# EAGLE board SPU_Rev_2.1 (EAGLE 9.6.2), part 1 of 3
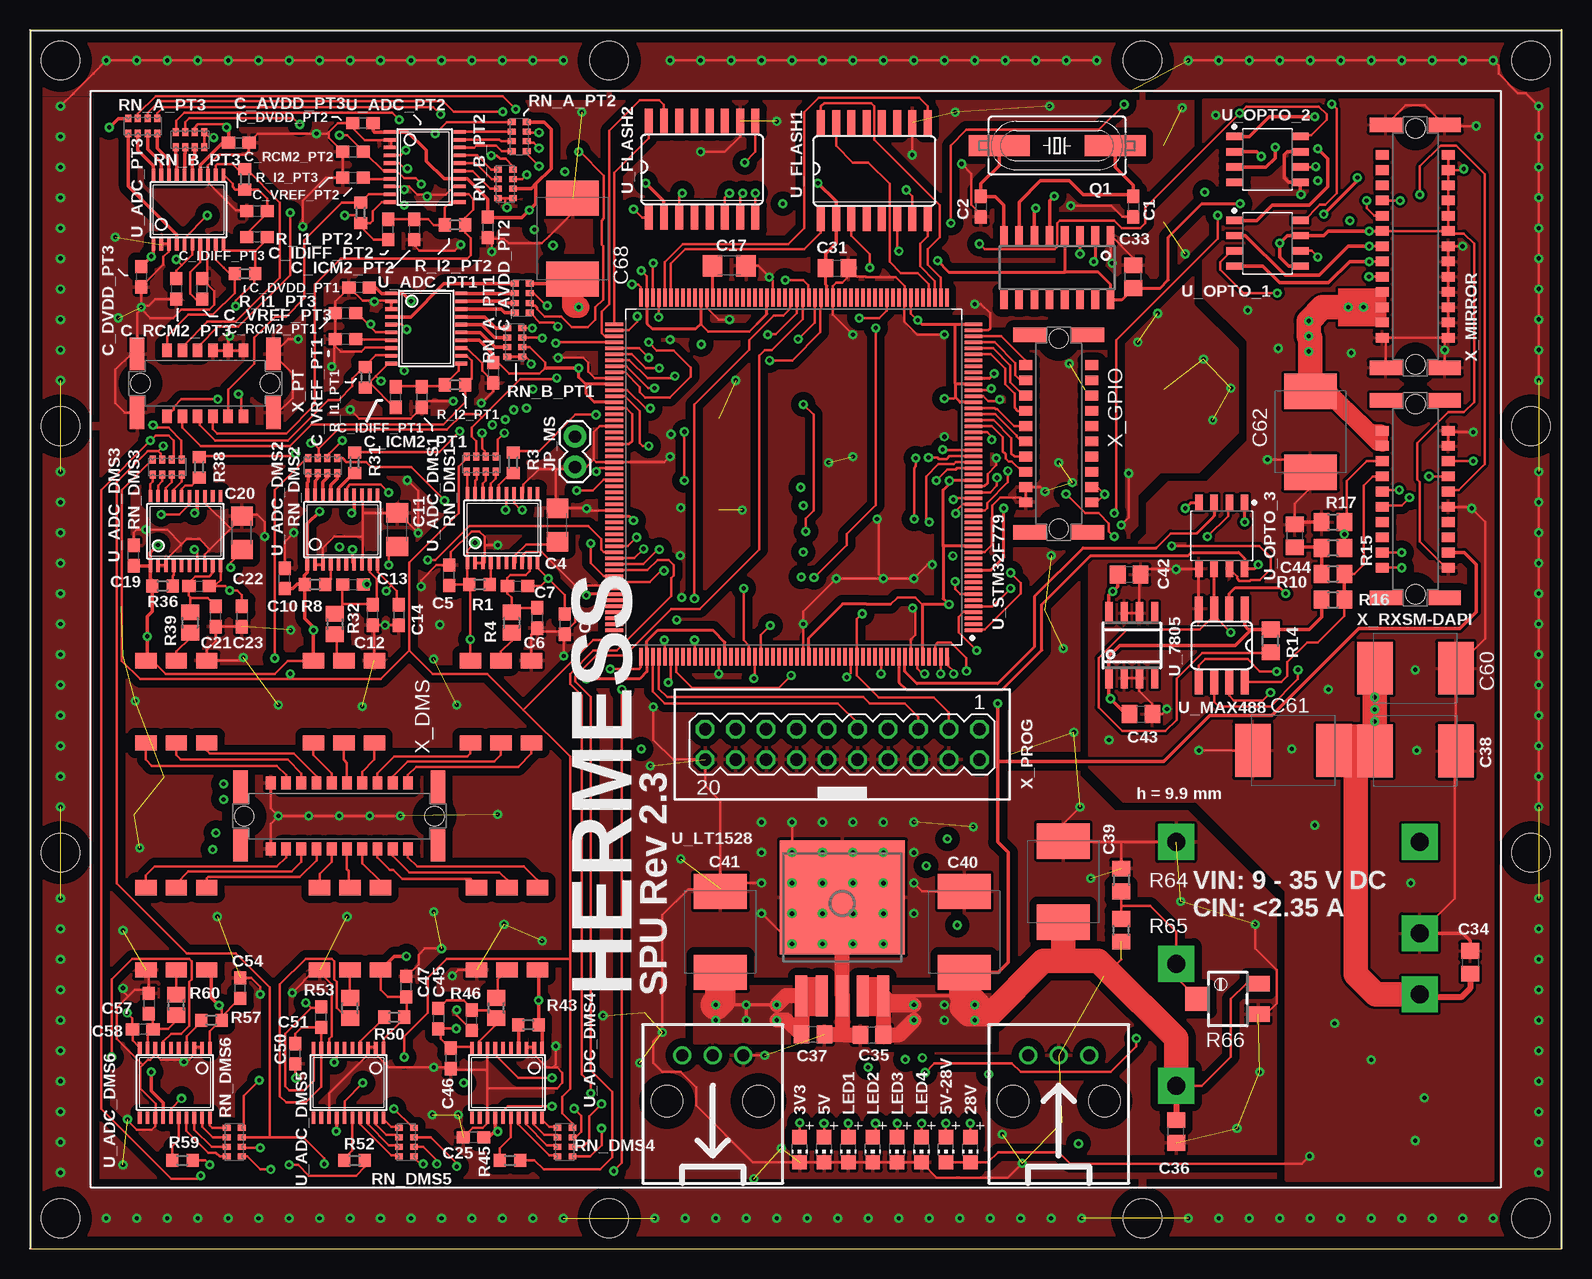
[diagram p8: board, top side]
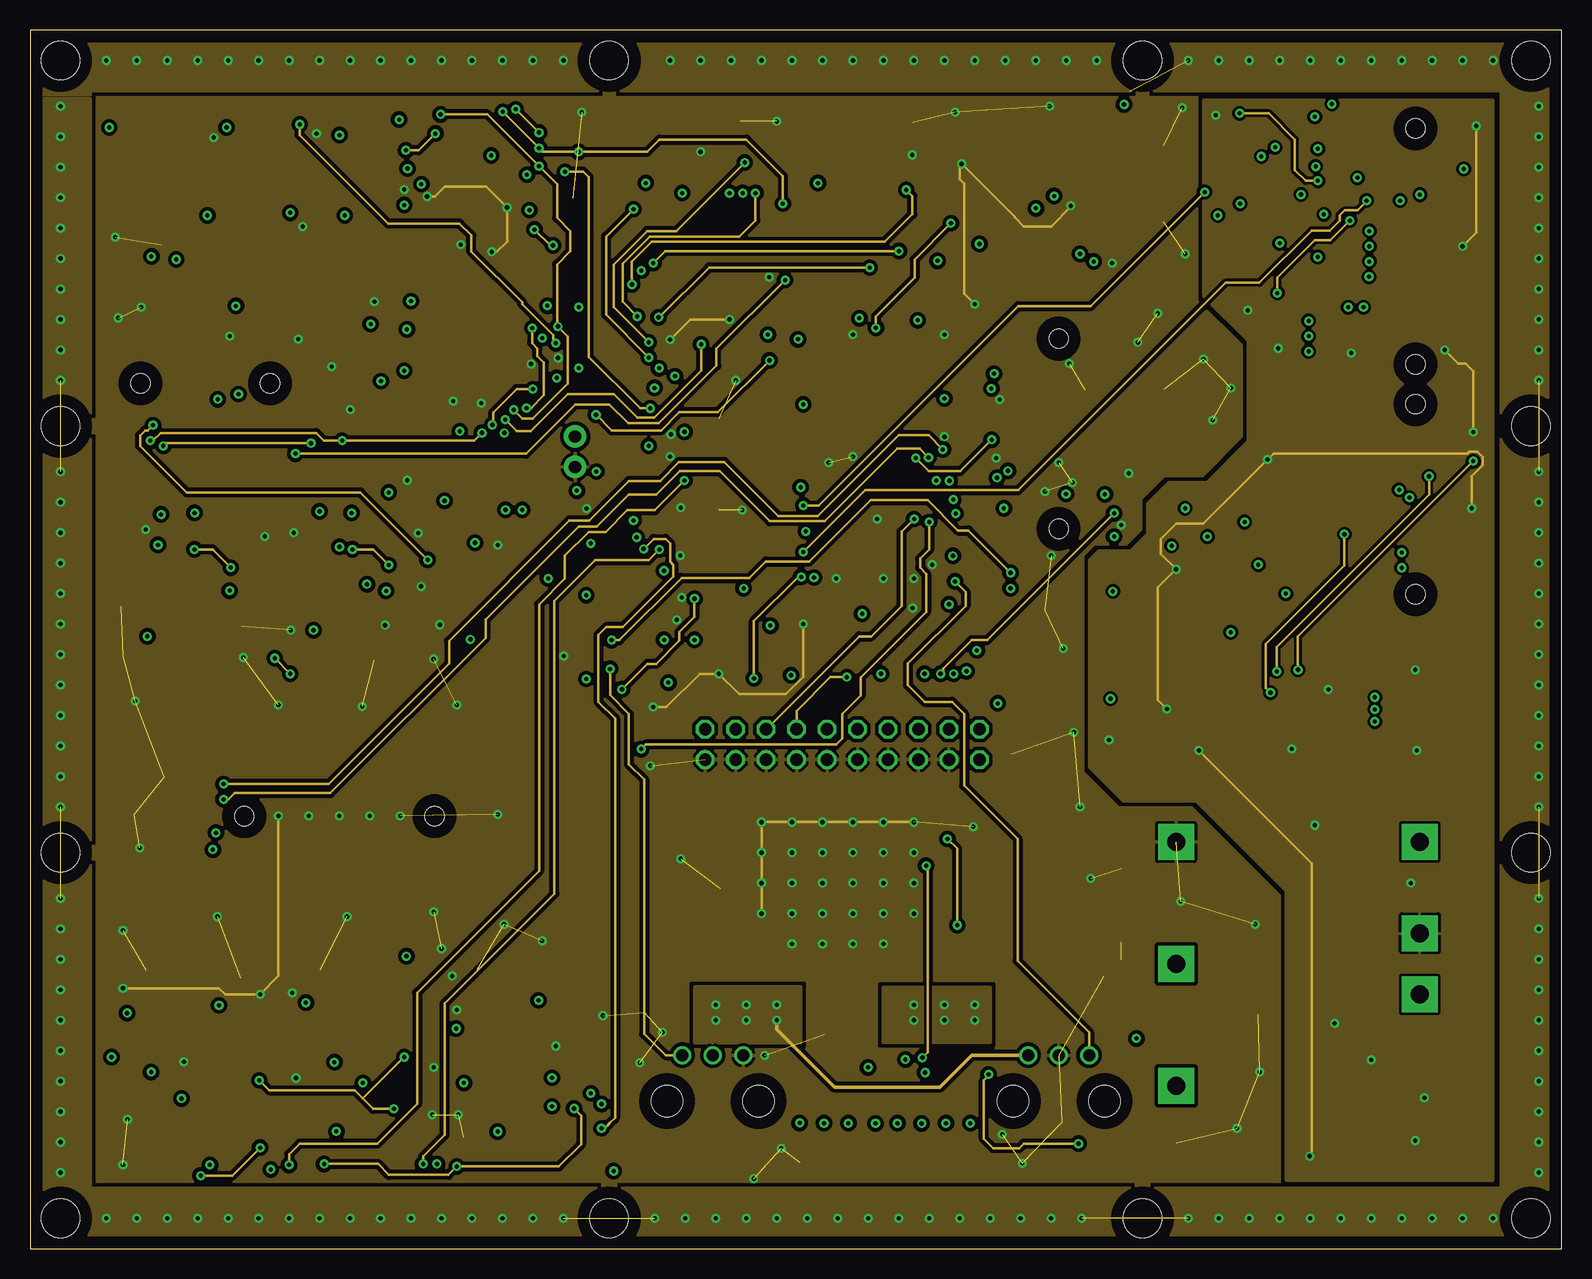
[diagram p9: board, inner layer Route2]
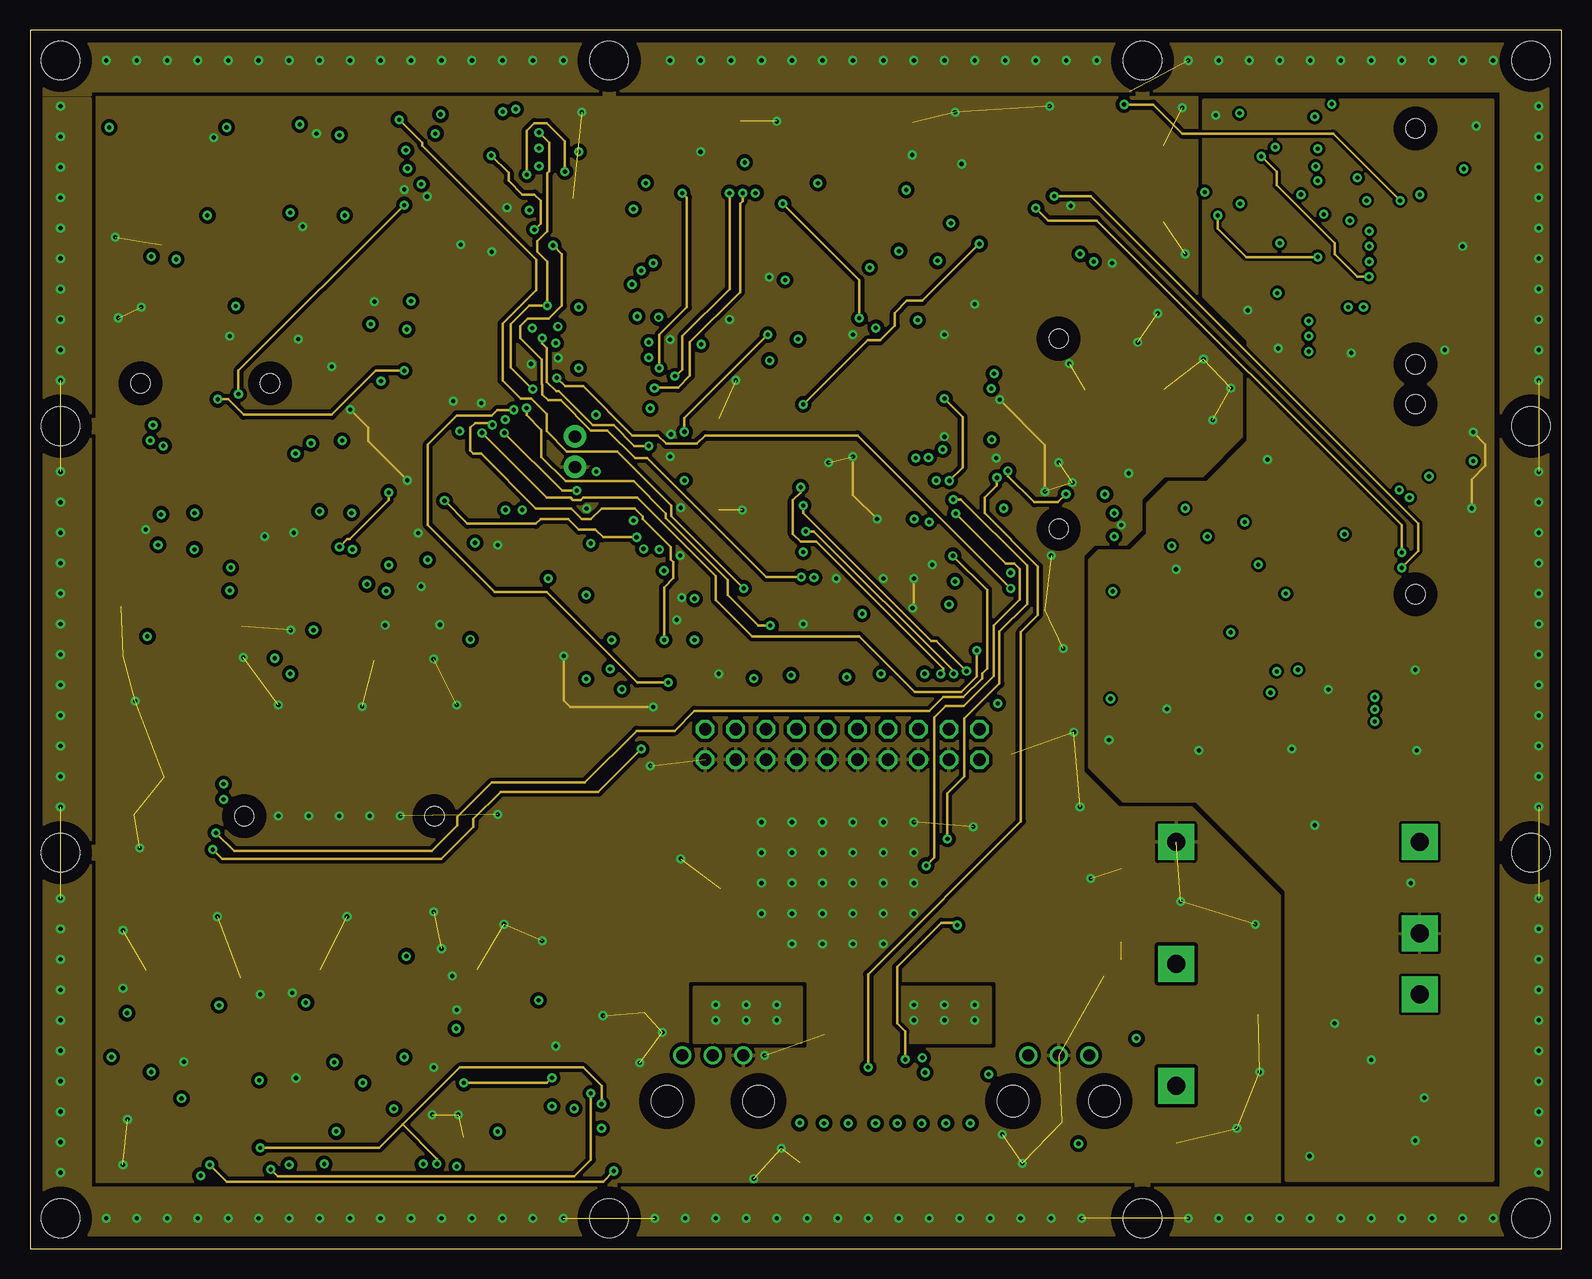
[diagram p10: board, inner layer Route15]
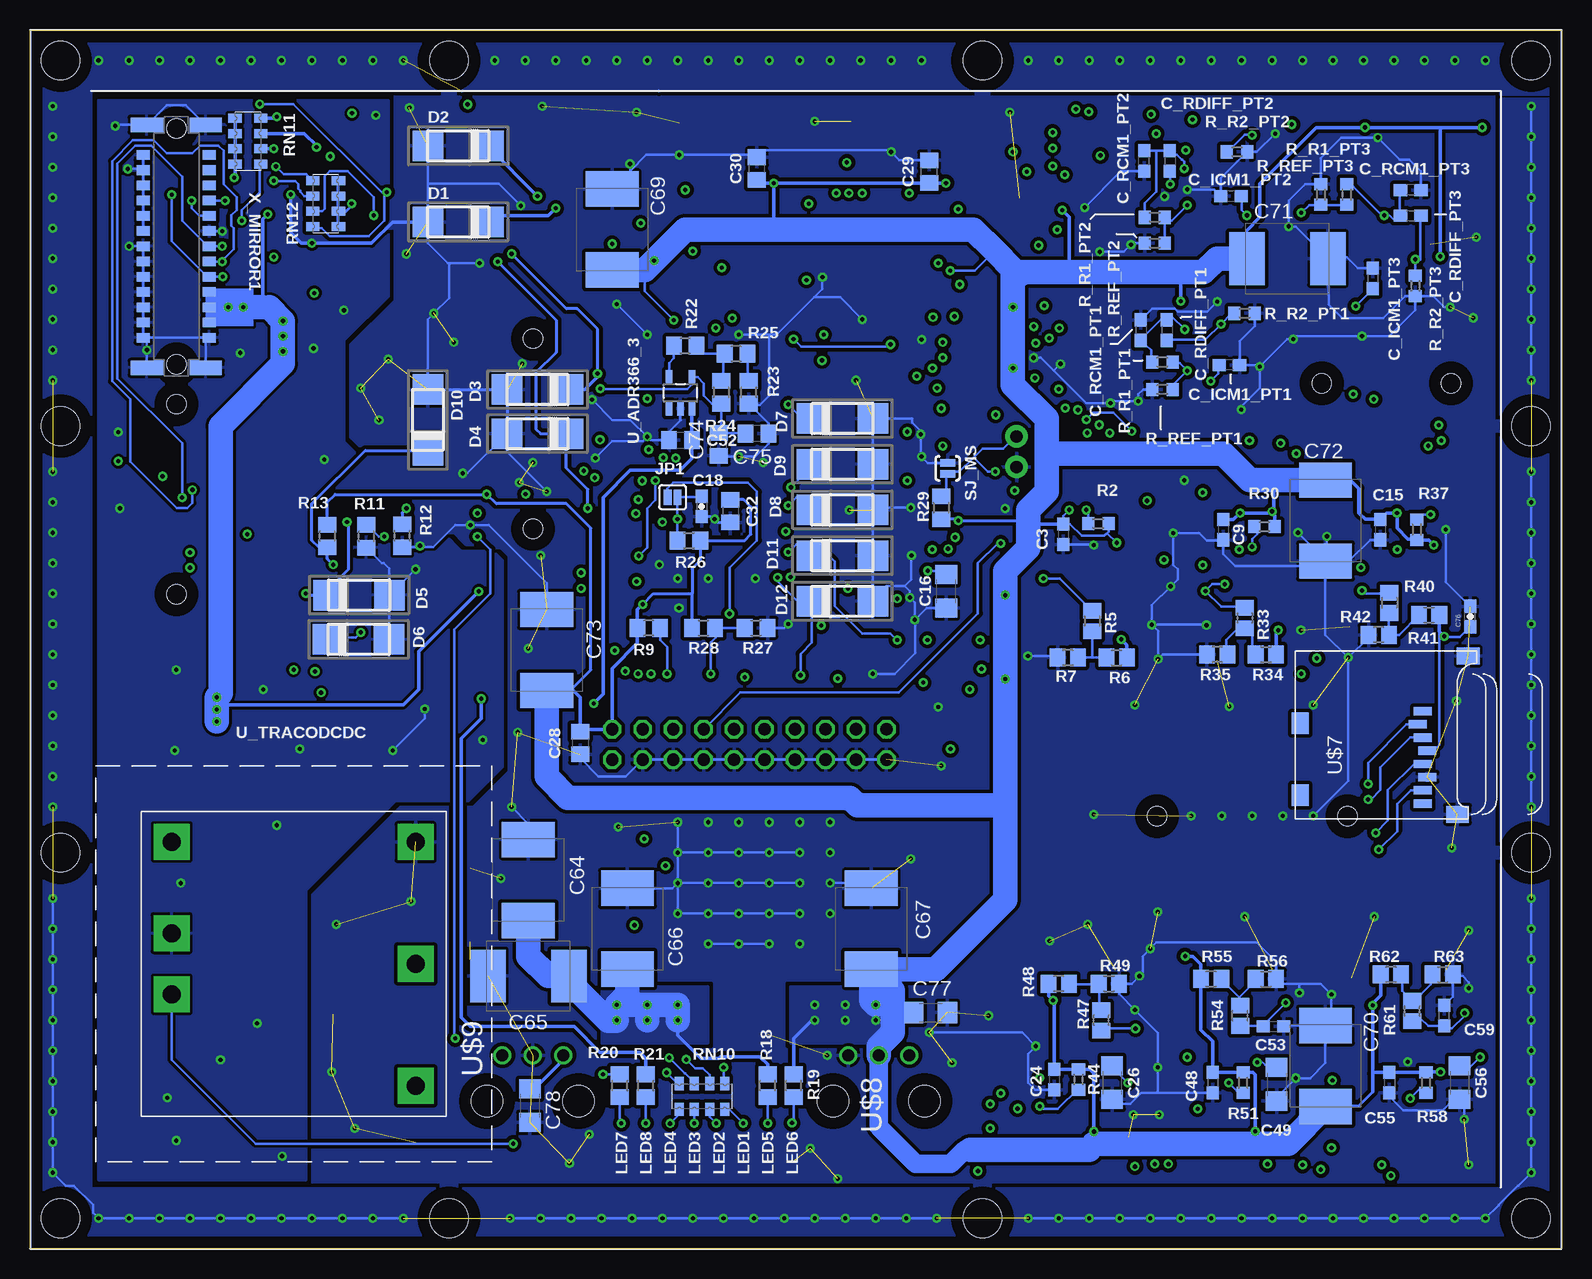
[diagram p11: board, bottom side, seen from below]

Size 127.64 x 101.6 mm. Coordinates in mm from the lower left corner, seen from the top.
Outline: 0,0 127.64,0 127.64,101.6 0,101.6 0,0
Copper layers (1+2+15+16): Top 0.035mm / dielectric 0.2mm / Route2 0.017mm / dielectric 0.2mm / Route15 0.017mm / dielectric 0.2mm / Bottom 0.035mm
Design rules "default *": minimum track width 8mil, minimum drill 0.35mm, track to track 9mil, track to pad 8mil, pad to pad 8mil, via to via 12mil, smd to smd 6mil, copper to edge 40mil, drill to drill 6mil, minimum pad ring 10mil, minimum via ring 8mil, stop-mask expansion 4mil, vias tented up to drill 0mil, thermal gap 10mil
Holes 3.2 mm at 2.54,99.06 2.54,2.54 125.1,2.54 125.1,99.06 48.26,99.06 92.71,99.06 48.26,2.54 92.71,2.54 2.54,68.58 2.54,33.02 125.1,33.02 125.1,68.58

## Footprints (pad centres in the part's own frame; a part is rotated, then mirrored left to right if it is on the bottom)
C0603 = smd 1.1 x 1: 1 -0.85,0; 2 0.85,0
C1206 = smd 1.6 x 1.8: 1 -1.4,0; 2 1.4,0
0603-CAP = smd 1.1 x 1: 1 -0.85,0; 2 0.85,0
C0805 = smd 1.3 x 1.5: 1 -0.95,0; 2 0.95,0
E/7260-38W = smd 2.95 x 4.4: + 3.375,0; - -3.375,0
DMELF = smd 2.54 x 2.54: A -2.54,0; C 2.54,0
SMT-JUMPER_2_NC_PASTE_SILK = smd 0.635 x 1.27: 1 -0.406,0; 2 0.406,0
1X02 = drill 1.016 pad 1.88: 1 0,0; 2 2.54,0
CHIP-LED0805 = smd 1.2 x 1.2: A 0,-1.05; C 0,1.05
SM49 = smd 5.08 x 1.778: 1 -4.826,0; 2 4.826,0
R0603 = smd 1 x 1.1: 1 -0.85,0; 2 0.85,0
R0805 = smd 1.3 x 1.5: 1 -0.85,0; 2 0.85,0
R0805' = smd 1.3 x 1.5: 1 -0.95,0; 2 0.95,0
RTRIM3224X = smd 1.32 x 1.9: 1 -1.27,-2.54; 3 1.27,-2.54 | smd 2 x 2: 2 0,2.54
EXBS8V = smd 0.75 x 1.1: 1 -1.905,-1.07; 2 -0.635,-1.07; 3 0.635,-1.07; 4 1.905,-1.07; 5 1.905,1.07; 6 0.635,1.07; 7 -0.635,1.07; 8 -1.905,1.07
0603-ARC = smd 0.5 x 0.65: 1 -1.2,-0.625; 2 -0.4,-0.625; 3 0.4,-0.625; 4 1.2,-0.625; 5 1.2,0.625; 6 0.4,0.625; 7 -0.4,0.625; 8 -1.2,0.625
SJ_2S-NO = smd 0.635 x 1.27: 1 -0.45,0; 2 0.45,0
COMMON_MODE_CHOKE = smd 1.27 x 1.78: P$1 0,5.08; P$2 6.86,5.08; P$3 0,2.54; P$4 6.86,2.54; P$5 0,0; P$6 6.86,0
MICROSD = smd 0.7 x 1.5: 1 9,-10.64; 2 7.9,-10.24; 3 6.8,-10.64; 4 5.7,-11.04; 5 4.6,-10.64; 6 3.5,-11.04; 7 2.4,-10.64; 8 1.3,-10.64 | smd 1.8 x 1.4: CD1 2,-0.44; CD2 8,-0.44 | smd 1.4 x 1.9: MT1 0.4,-13.54; MT2 13.6,-14.44
PLT131-T1 = drill 1: GND -2.54,0; VCC 0,0; VIN 2.54,0 | hole 2.6: -3.81,3.81; 3.81,3.81
PLR135-T1 = drill 1: GND 0,0; VCC 2.54,0; VOUT -2.54,0 | hole 2.6: -3.81,3.81; 3.81,3.81
SOIC8 = smd 0.6 x 1.8: 1 -1.905,-2.7; 2 -0.635,-2.7; 3 0.635,-2.7; 4 1.905,-2.7; 5 1.905,2.7; 6 0.635,2.7; 7 -0.635,2.7; 8 -1.905,2.7
TSSOP20 = smd 0.305 x 0.991: 1 -2.925,-2.918; 2 -2.275,-2.918; 3 -1.625,-2.918; 4 -0.975,-2.918; 5 -0.325,-2.918; 6 0.325,-2.918; 7 0.975,-2.918; 8 1.625,-2.918; 9 2.275,-2.918; 10 2.925,-2.918; 11 2.925,2.918; 12 2.275,2.918; 13 1.625,2.918; 14 0.975,2.918; 15 0.325,2.918; 16 -0.325,2.918; 17 -0.975,2.918; 18 -1.625,2.918; 19 -2.275,2.918; 20 -2.925,2.918
SOT23-5 = smd 0.55 x 1.2: 1 -0.95,-1.3; 2 0,-1.3; 3 0.95,-1.3; 4 0.95,1.3; 5 -0.95,1.3
SOIC16 = smd 0.635 x 1.524: 1 -4.445,-2.695; 2 -3.175,-2.695; 3 -1.905,-2.695; 4 -0.635,-2.695; 5 0.635,-2.695; 6 1.905,-2.695; 7 3.175,-2.695; 8 4.445,-2.695; 9 4.445,2.695; 10 3.175,2.695; 11 1.905,2.695; 12 0.635,2.695; 13 -0.635,2.695; 14 -1.905,2.695; 15 -3.175,2.695; 16 -4.445,2.695
SO16 = smd 0.66 x 2.032: 1 -4.445,-3.073; 2 -3.175,-3.073; 3 -1.905,-3.073; 4 -0.635,-3.073; 5 0.635,-3.073; 6 1.905,-3.073; 7 3.175,-3.073; 8 4.445,-3.073; 9 4.445,4.978; 10 3.175,4.978; 11 1.905,4.978; 12 0.635,4.978; 13 -0.635,4.978; 14 -1.905,4.978; 15 -3.175,4.978; 16 -4.445,4.978
Q5-DD = smd 1 x 3.4: 1 -3.4,-7.875; 2 -1.7,-7.875; 3 0,-7.875; 4 1.7,-7.875; 5 3.4,-7.875 | smd 10.414 x 9.525: 6 0,0.325
SO08 = smd 0.66 x 2.032: 1 -1.905,-3.073; 2 -0.635,-3.073; 3 0.635,-3.073; 4 1.905,-3.073; 5 1.905,3.073; 6 0.635,3.073; 7 -0.635,3.073; 8 -1.905,3.073
SOIC127P594X363-8N = smd 1.44 x 0.614: 1 -2.731,1.905; 2 -2.731,0.635; 3 -2.731,-0.635; 4 -2.731,-1.905; 5 2.731,-1.905; 6 2.731,-0.635; 7 2.731,0.635; 8 2.731,1.905
QFP50P3060X3060X385-208 = smd 1.469 x 0.28: 1 -14.971,12.75; 2 -14.971,12.25; 3 -14.971,11.75; 4 -14.971,11.25; 5 -14.971,10.75; 6 -14.971,10.25; 7 -14.971,9.75; 8 -14.971,9.25; 9 -14.971,8.75; 10 -14.971,8.25; 11 -14.971,7.75; 12 -14.971,7.25; 13 -14.971,6.75; 14 -14.971,6.25; 15 -14.971,5.75; 16 -14.971,5.25; 17 -14.971,4.75; 18 -14.971,4.25; 19 -14.971,3.75; 20 -14.971,3.25; 21 -14.971,2.75; 22 -14.971,2.25; 23 -14.971,1.75; 24 -14.971,1.25; 25 -14.971,0.75; 26 -14.971,0.25; 27 -14.971,-0.25; 28 -14.971,-0.75; 29 -14.971,-1.25; 30 -14.971,-1.75; 31 -14.971,-2.25; 32 -14.971,-2.75; 33 -14.971,-3.25; 34 -14.971,-3.75; 35 -14.971,-4.25; 36 -14.971,-4.75; 37 -14.971,-5.25; 38 -14.971,-5.75; 39 -14.971,-6.25; 40 -14.971,-6.75; 41 -14.971,-7.25; 42 -14.971,-7.75; 43 -14.971,-8.25; 44 -14.971,-8.75; 45 -14.971,-9.25; 46 -14.971,-9.75; 47 -14.971,-10.25; 48 -14.971,-10.75; 49 -14.971,-11.25; 50 -14.971,-11.75; 51 -14.971,-12.25; 52 -14.971,-12.75; 105 14.971,-12.75; 106 14.971,-12.25; 107 14.971,-11.75; 108 14.971,-11.25; 109 14.971,-10.75; 110 14.971,-10.25; 111 14.971,-9.75; 112 14.971,-9.25; 113 14.971,-8.75; 114 14.971,-8.25; 115 14.971,-7.75; 116 14.971,-7.25; 117 14.971,-6.75; 118 14.971,-6.25; 119 14.971,-5.75; 120 14.971,-5.25; 121 14.971,-4.75; 122 14.971,-4.25; 123 14.971,-3.75; 124 14.971,-3.25; 125 14.971,-2.75; 126 14.971,-2.25; 127 14.971,-1.75; 128 14.971,-1.25; 129 14.971,-0.75; 130 14.971,-0.25; 131 14.971,0.25; 132 14.971,0.75; 133 14.971,1.25; 134 14.971,1.75; 135 14.971,2.25; 136 14.971,2.75; 137 14.971,3.25; 138 14.971,3.75; 139 14.971,4.25; 140 14.971,4.75; 141 14.971,5.25; 142 14.971,5.75; 143 14.971,6.25; 144 14.971,6.75; 145 14.971,7.25; 146 14.971,7.75; 147 14.971,8.25; 148 14.971,8.75; 149 14.971,9.25; 150 14.971,9.75; 151 14.971,10.25; 152 14.971,10.75; 153 14.971,11.25; 154 14.971,11.75; 155 14.971,12.25; 156 14.971,12.75 | smd 0.28 x 1.469: 53 -12.75,-14.971; 54 -12.25,-14.971; 55 -11.75,-14.971; 56 -11.25,-14.971; 57 -10.75,-14.971; 58 -10.25,-14.971; 59 -9.75,-14.971; 60 -9.25,-14.971; 61 -8.75,-14.971; 62 -8.25,-14.971; 63 -7.75,-14.971; 64 -7.25,-14.971; 65 -6.75,-14.971; 66 -6.25,-14.971; 67 -5.75,-14.971; 68 -5.25,-14.971; 69 -4.75,-14.971; 70 -4.25,-14.971; 71 -3.75,-14.971; 72 -3.25,-14.971; 73 -2.75,-14.971; 74 -2.25,-14.971; 75 -1.75,-14.971; 76 -1.25,-14.971; 77 -0.75,-14.971; 78 -0.25,-14.971; 79 0.25,-14.971; 80 0.75,-14.971; 81 1.25,-14.971; 82 1.75,-14.971; 83 2.25,-14.971; 84 2.75,-14.971; 85 3.25,-14.971; 86 3.75,-14.971; 87 4.25,-14.971; 88 4.75,-14.971; 89 5.25,-14.971; 90 5.75,-14.971; 91 6.25,-14.971; 92 6.75,-14.971; 93 7.25,-14.971; 94 7.75,-14.971; 95 8.25,-14.971; 96 8.75,-14.971; 97 9.25,-14.971; 98 9.75,-14.971; 99 10.25,-14.971; 100 10.75,-14.971; 101 11.25,-14.971; 102 11.75,-14.971; 103 12.25,-14.971; 104 12.75,-14.971; 157 12.75,14.971; 158 12.25,14.971; 159 11.75,14.971; 160 11.25,14.971; 161 10.75,14.971; 162 10.25,14.971; 163 9.75,14.971; 164 9.25,14.971; 165 8.75,14.971; 166 8.25,14.971; 167 7.75,14.971; 168 7.25,14.971; 169 6.75,14.971; 170 6.25,14.971; 171 5.75,14.971; 172 5.25,14.971; 173 4.75,14.971; 174 4.25,14.971; 175 3.75,14.971; 176 3.25,14.971; 177 2.75,14.971; 178 2.25,14.971; 179 1.75,14.971; 180 1.25,14.971; 181 0.75,14.971; 182 0.25,14.971; 183 -0.25,14.971; 184 -0.75,14.971; 185 -1.25,14.971; 186 -1.75,14.971; 187 -2.25,14.971; 188 -2.75,14.971; 189 -3.25,14.971; 190 -3.75,14.971; 191 -4.25,14.971; 192 -4.75,14.971; 193 -5.25,14.971; 194 -5.75,14.971; 195 -6.25,14.971; 196 -6.75,14.971; 197 -7.25,14.971; 198 -7.75,14.971; 199 -8.25,14.971; 200 -8.75,14.971; 201 -9.25,14.971; 202 -9.75,14.971; 203 -10.25,14.971; 204 -10.75,14.971; 205 -11.25,14.971; 206 -11.75,14.971; 207 -12.25,14.971; 208 -12.75,14.971
THL_20WI_SERIES = drill 1.5 pad 3 square: 1 -2.54,10.16; 2 2.54,10.16; 3 -10.16,-10.16; 4 0,-10.16; 5 10.16,-10.16; 6 10.16,10.16
403-5X020-5X = smd 0.8 x 1.1: P$A1 5.715,-2.75; P$A2 4.445,-2.75; P$A3 3.175,-2.75; P$A4 1.905,-2.75; P$A5 0.635,-2.75; P$A6 -0.635,-2.75; P$A7 -1.905,-2.75; P$A8 -3.175,-2.75; P$A9 -4.445,-2.75; P$A10 -5.715,-2.75; P$B1 5.715,2.75; P$B2 4.445,2.75; P$B3 3.175,2.75; P$B4 1.905,2.75; P$B5 0.635,2.75; P$B6 -0.635,2.75; P$B7 -1.905,2.75; P$B8 -3.175,2.75; P$B9 -4.445,2.75; P$B10 -5.715,2.75 | smd 1.2 x 2.7: P$BL1 -8.225,2.45; P$BL2 8.225,2.45; P$BL3 -8.225,-2.45; P$BL4 8.225,-2.45 | hole 1.6: -7.925,0; 7.925,0
403-5X026-5X = smd 0.8 x 1.1: P$A1 7.62,-2.75; P$A2 6.35,-2.75; P$A3 5.08,-2.75; P$A4 3.81,-2.75; P$A5 2.54,-2.75; P$A6 1.27,-2.75; P$A7 0,-2.75; P$A8 -1.27,-2.75; P$A9 -2.54,-2.75; P$A10 -3.81,-2.75; P$A11 -5.08,-2.75; P$A12 -6.35,-2.75; P$A13 -7.62,-2.75; P$B1 7.62,2.75; P$B2 6.35,2.75; P$B3 5.08,2.75; P$B4 3.81,2.75; P$B5 2.54,2.75; P$B6 1.27,2.75; P$B7 0,2.75; P$B8 -1.27,2.75; P$B9 -2.54,2.75; P$B10 -3.81,2.75; P$B11 -5.08,2.75; P$B12 -6.35,2.75; P$B13 -7.62,2.75 | smd 1.2 x 2.7: P$BL1 -10.13,2.45; P$BL2 10.13,2.45; P$BL3 -10.13,-2.45; P$BL4 10.13,-2.45 | hole 1.6: -9.83,0; 9.83,0
MA10-2 = drill 1.016 octagon: 1 -11.43,-1.27; 2 -11.43,1.27; 3 -8.89,-1.27; 4 -8.89,1.27; 5 -6.35,-1.27; 6 -6.35,1.27; 7 -3.81,-1.27; 8 -3.81,1.27; 9 -1.27,-1.27; 10 -1.27,1.27; 11 1.27,-1.27; 12 1.27,1.27; 13 3.81,-1.27; 14 3.81,1.27; 15 6.35,-1.27; 16 6.35,1.27; 17 8.89,-1.27; 18 8.89,1.27; 19 11.43,-1.27; 20 11.43,1.27
403-5X012-5X = smd 0.8 x 1.1: P$A1 3.175,-2.75; P$A2 1.905,-2.75; P$A3 0.635,-2.75; P$A4 -0.635,-2.75; P$A5 -1.905,-2.75; P$A6 -3.175,-2.75; P$B1 3.175,2.75; P$B2 1.905,2.75; P$B3 0.635,2.75; P$B4 -0.635,2.75; P$B5 -1.905,2.75; P$B6 -3.175,2.75 | smd 1.2 x 2.7: P$BL1 -5.685,2.45; P$BL2 5.685,2.45; P$BL3 -5.685,-2.45; P$BL4 5.685,-2.45 | hole 1.6: -5.385,0; 5.385,0

## Placement (x,y rotation side)
C1  22p  [C0603]  91.95,86.87 270 top
C2  22p  [C0603]  79.25,86.87 270 top
C3  100n  [C0603]  41.53,59.56 270 bottom
C4  1u  [C1206]  43.94,60.33 90 top
C5  100n  [C0603]  34.93,56.13 90 top
C6  100n  [C0603]  42.29,52.58 90 top
C7  100n  [C0603]  40.64,55.24 0 top
C8  100n  [C0603]  44.58,52.07 270 top
C9  100n  [C0603]  28.19,59.94 270 bottom
C10  100n  [C0603]  21.21,55.88 90 top
C11  1u  [C1206]  30.61,59.94 90 top
C12  100n  [C0603]  28.58,52.83 90 top
C13  100n  [C0603]  26.92,55.37 0 top
C14  100n  [C0603]  30.73,52.83 270 top
C15  100n  [C0603]  15.11,59.94 270 bottom
C16  2.2u  [C1206]  51.28,54.81 90 bottom
C17  2.2u  [C1206]  58.27,81.94 180 top
C18  100n  [0603-CAP]  71.67,61.88 270 bottom
C19  100n  [C0603]  8.64,57.78 90 top
C20  1u  [C1206]  17.65,59.69 90 top
C21  100n  [C0603]  15.49,52.7 90 top
C22  100n  [C0603]  14.1,55.24 0 top
C23  100n  [C0603]  17.65,52.7 270 top
C24  100n  [C0603]  42.29,14.1 270 bottom
C25  100n  [C0603]  36.96,9.27 180 top
C26  1u  [C1206]  37.47,13.84 270 bottom
C27  100n  [C0603]  36.83,19.05 90 top
C28  100n  [C0805]  81.79,42.16 270 bottom
C29  100n  [C0805]  52.7,89.79 90 bottom
C30  100n  [C0805]  67.06,90.04 90 bottom
C31  100n  [C0805]  67.25,81.74 0 top
C32  100n  [C0805]  69.26,61.5 270 bottom
C33  100n  [C0805]  91.95,81.03 90 top
C34  100n  [C0805]  120.02,23.88 270 top
C35  100n  [C0805]  70.15,17.83 0 top
C36  100n  [C0805]  95.5,9.78 90 top
C37  100n  [C0805]  65.25,17.86 180 top
C38  10u  [E/7260-38W]  115.44,41.5 180 top
C39  10u  [E/7260-38W]  86.11,30.61 270 top
C40  10u  [E/7260-38W]  77.85,26.42 270 top
C41  10u  [E/7260-38W]  57.53,26.42 270 top
C42  100n  [C0805]  91.59,56.18 180 top
C43  100n  [C0805]  92.58,44.58 0 top
C44  ~0  [C0805]  105.41,59.44 90 top
C45  100n  [C0603]  34.04,19.18 270 top
C46  100n  [C0603]  35.05,15.88 270 top
C47  100n  [C0603]  31.37,21.84 90 top
C48  100n  [C0603]  29.08,13.84 270 bottom
C49  1u  [C1206]  23.75,13.72 270 bottom
C50  100n  [C0603]  22.1,16.26 90 top
C51  100n  [C0603]  24.26,19.3 90 top
C52  10n  [C0805]  73.43,67.41 0 bottom
C53  100n  [C0603]  24,18.54 0 bottom
C54  100n  [C0603]  17.53,21.72 90 top
C55  100n  [C0603]  14.35,13.84 270 bottom
C56  1u  [C1206]  8.51,13.84 270 bottom
C57  100n  [C0603]  9.91,20.45 270 top
C58  100n  [C0603]  9.4,18.29 180 top
C59  100n  [C0603]  9.78,19.43 90 bottom
C60  10u  [E/7260-38W]  115.44,48.39 180 top
C61  10u  [E/7260-38W]  105.28,41.53 0 top
C62  10u  [E/7260-38W]  106.71,68.1 90 top
C64  10u  [E/7260-38W]  86.11,30.73 270 bottom
C65  10u  [E/7260-38W]  86.11,22.73 0 bottom
C66  10u  [E/7260-38W]  77.85,26.67 270 bottom
C67  10u  [E/7260-38W]  57.53,26.67 270 bottom
C68  10u  [E/7260-38W]  45.21,84.2 270 top
C69  10u  [E/7260-38W]  79.12,84.96 270 bottom
C70  10u  [E/7260-38W]  19.69,15.24 270 bottom
C71  10u  [E/7260-38W]  22.86,82.55 180 bottom
C72  10u  [E/7260-38W]  19.69,60.71 90 bottom
C73  10u  [E/7260-38W]  84.58,49.91 270 bottom
C74  10n  [C0805]  70.23,67.06 90 bottom
C75  100n  [C0805]  67.06,67.94 180 bottom
C76  100n  [0603-CAP]  7.62,52.7 90 bottom
C77  100n  [C1206]  52.58,19.68 0 bottom
C78  100n  [C1206]  85.98,11.94 270 bottom
C_AVDD_PT1  100n  [C0603]  38.61,73.03 270 top
C_AVDD_PT2  100n  [C0603]  38.15,85.14 270 top
C_AVDD_PT3  100n  [C0603]  17.4,92.2 0 top
C_DVDD_PT1  100n  [C0603]  27.43,80.14 180 top
C_DVDD_PT2  100n  [C0603]  27.74,93.83 180 top
C_DVDD_PT3  100n  [C0603]  9.27,81.03 270 top
C_ICM1_PT1  [C0603]  27.69,73.66 180 bottom
C_ICM1_PT2  [C0603]  27.56,87.76 0 bottom
C_ICM1_PT3  4n7  [C0603]  15.75,80.9 270 bottom
C_ICM2_PT1  [C0603]  32.64,70.99 270 top
C_ICM2_PT2  [C0603]  32,84.96 270 top
C_ICM2_PT3  4n7  [C0603]  18.92,86.49 180 top
C_IDIFF_PT1  [C0603]  30.48,70.99 90 top
C_IDIFF_PT2  [C0603]  29.84,84.96 90 top
C_IDIFF_PT3  47n  [C0603]  18.92,84.33 180 top
C_RCM1_PT1  [C0603]  35.05,76.58 270 bottom
C_RCM1_PT2  [C0603]  34.8,90.68 90 bottom
C_RCM1_PT3  [C0603]  12.57,88.27 180 bottom
C_RCM2_PT1  [C0603]  26.29,77.98 180 top
C_RCM2_PT2  [C0603]  26.92,91.44 180 top
C_RCM2_PT3  [C0603]  12.19,80.01 270 top
C_RDIFF_PT1  [C0603]  32.89,76.58 270 bottom
C_RDIFF_PT2  [C0603]  32.64,90.68 270 bottom
C_RDIFF_PT3  100n  [C0603]  12.57,86.11 0 bottom
C_VREF_PT1  1u  [C0603]  26.29,75.82 180 top
C_VREF_PT2  1u  [C0603]  26.92,89.28 180 top
C_VREF_PT3  1u  [C0603]  14.35,80.01 90 top
D1  5V6  [DMELF]  91.95,85.6 0 bottom
D2  5V6  [DMELF]  91.95,91.95 0 bottom
D3  3V6  [DMELF]  85.34,71.63 0 bottom
D4  3V6  [DMELF]  85.34,67.94 0 bottom
D5  5V6  [DMELF]  100.2,54.48 180 bottom
D6  5V6  [DMELF]  100.25,50.8 180 bottom
D7  3V6  [DMELF]  59.94,69.22 180 bottom
D8  3V6  [DMELF]  59.94,61.59 180 bottom
D9  3V6  [DMELF]  59.94,65.41 180 bottom
D10  3V6  [DMELF]  94.49,69.09 270 bottom
D11  3V6  [DMELF]  59.94,57.78 180 bottom
D12  3V6  [DMELF]  59.94,53.98 180 bottom
JP1  JUMPER-SMT_2_NC_PASTE_SILK  [SMT-JUMPER_2_NC_PASTE_SILK]  74.09,62.64 180 bottom
JP_MS  x  [1X02]  45.42,65.17 90 top
LED1  1V9  [CHIP-LED0805]  68.2,8.26 180 top
LED2  1V9  [CHIP-LED0805]  70.23,8.26 180 top
LED3  1V9  [CHIP-LED0805]  72.26,8.26 180 top
LED4  1V9  [CHIP-LED0805]  74.3,8.26 180 top
LED5  1V9  [CHIP-LED0805]  66.17,8.26 180 top
LED6  1V9  [CHIP-LED0805]  64.14,8.26 180 top
LED7  1V9  [CHIP-LED0805]  78.36,8.26 180 top
LED8  1V9  [CHIP-LED0805]  76.33,8.26 180 top
Q1  12MHz  [SM49]  85.6,91.95 180 top
R1  4k7  [R0603]  37.47,55.37 0 top
R2  4k7  [R0603]  38.61,60.45 0 bottom
R3  47  [R0603]  40.26,65.53 90 top
R4  40 1%  [R0805]  40.13,52.2 270 top
R5  40 1%  [R0805]  39.12,52.32 270 bottom
R6  1k 0.1%  [R0805]  37.08,49.28 0 bottom
R7  1k 0.1%  [R0805]  41.15,49.28 180 bottom
R8  4k7  [R0603]  23.75,55.37 0 top
R9  10k  [R0805']  76.07,51.75 180 bottom
R10  500  [R0805']  108.59,56.26 0 top
R11  3k  [R0805']  99.59,59.39 90 bottom
R12  2k  [R0805']  96.62,59.44 90 bottom
R13  4k7  [R0805']  102.84,59.41 90 bottom
R14  7k5  [R0805']  103.38,50.67 90 top
R15  500  [R0805']  108.59,58.42 180 top
R16  3k3  [R0805']  108.59,54.1 0 top
R17  3k3  [R0805']  108.59,60.58 0 top
R18  680  [R0805']  66.17,13.59 90 bottom
R19  330  [R0805']  64.01,13.59 90 bottom
R20  4k7  [R0805']  78.49,13.59 90 bottom
R21  470  [R0805']  76.33,13.59 90 bottom
R22  100k  [R0805']  73.03,75.29 0 bottom
R23  1k  [R0805']  67.74,71.4 90 bottom
R24  ?  [R0805']  70.03,71.4 270 bottom
R25  ?  [R0805']  68.79,74.6 180 bottom
R26  10k  [R0805']  72.73,59.04 0 bottom
R27  10k  [R0805']  67.12,51.75 0 bottom
R28  99M  [R0805']  71.51,51.75 0 bottom
R29  10k  [R0805']  51.7,61.77 270 bottom
R30  4k7  [R0603]  24.77,60.2 0 bottom
R31  47  [R0603]  27.05,65.53 90 top
R32  40 1%  [R0805]  25.4,52.07 270 top
R33  40 1%  [R0805]  26.42,52.58 270 bottom
R34  1k 0.1%  [R0805]  24.64,49.53 0 bottom
R35  1k 0.1%  [R0805]  28.7,49.53 180 bottom
R36  4k7  [R0603]  11.05,55.24 0 top
R37  4k7  [R0603]  12.06,59.94 270 bottom
R38  47  [R0603]  14.1,65.15 90 top
R39  40 1%  [R0805]  13.33,52.2 270 top
R40  40 1%  [R0805]  14.35,53.85 270 bottom
R41  1k 0.1%  [R0805]  11.05,52.83 0 bottom
R42  1k 0.1%  [R0805]  15.24,51.18 180 bottom
R43  4k7  [R0603]  41.53,18.67 180 top
R44  4k7  [R0603]  40.26,14.1 90 bottom
R45  47  [R0603]  40.01,7.37 0 top
R46  40 1%  [R0805]  38.86,20.07 90 top
R47  40 1%  [R0805]  38.35,19.05 90 bottom
R48  1k 0.1%  [R0805]  41.91,22.1 180 bottom
R49  1k 0.1%  [R0805]  37.72,22.1 0 bottom
R50  4k7  [R0603]  30.35,19.3 180 top
R51  4k7  [R0603]  26.54,13.84 90 bottom
R52  47  [R0603]  27.05,7.37 0 top
R53  40 1%  [R0805]  26.67,20.07 90 top
R54  40 1%  [R0805]  26.8,19.43 90 bottom
R55  1k 0.1%  [R0805]  29.21,22.48 180 bottom
R56  1k 0.1%  [R0805]  24.64,22.48 0 bottom
R57  4k7  [R0603]  15.11,19.05 180 top
R58  4k7  [R0603]  11.3,13.84 90 bottom
R59  47  [R0603]  12.7,7.37 0 top
R60  40 1%  [R0805]  12.19,20.32 90 top
R61  40 1%  [R0805]  12.45,19.81 90 bottom
R62  1k 0.1%  [R0805]  14.22,22.86 180 bottom
R63  1k 0.1%  [R0805]  9.91,22.86 0 bottom
R64  inf  [R0805']  90.93,30.73 270 top
R65  inf  [R0805']  90.93,26.54 90 top
R66  inf  [RTRIM3224X]  99.82,20.83 90 top
R_I1_PT1  [R0603]  27.94,72.64 90 top
R_I1_PT2  [R0603]  27.56,86.36 90 top
R_I1_PT3  5k  [R0603]  17.91,81.28 180 top
R_I2_PT1  [R0603]  35.43,72.01 0 top
R_I2_PT2  [R0603]  35.43,85.34 0 top
R_I2_PT3  5k  [R0603]  17.91,89.15 90 top
R_R1_PT1  [R0603]  33.27,73.91 0 bottom
R_R1_PT2  [R0603]  33.91,85.98 0 bottom
R_R1_PT3  3k16  [R0603]  17.91,87.88 270 bottom
R_R2_PT1  [R0603]  26.42,77.98 0 bottom
R_R2_PT2  [R0603]  27.05,91.44 0 bottom
R_R2_PT3  inf  [R0603]  12.19,80.26 270 bottom
R_REF_PT1  [R0603]  33.27,71.63 0 bottom
R_REF_PT2  [R0603]  33.91,83.82 0 bottom
R_REF_PT3  1k62  [R0603]  20.07,87.88 270 bottom
RN10  330  [EXBS8V]  71.63,12.7 180 bottom
RN11  3k  [EXBS8V]  109.47,92.33 270 bottom
RN12  1k  [EXBS8V]  103,87.12 90 bottom
RN_A_PT1  47  [0603-ARC]  41.02,79.25 270 top
RN_A_PT2  47  [0603-ARC]  40.77,92.71 270 top
RN_A_PT3  47  [0603-ARC]  9.4,93.6 0 top
RN_B_PT1  47  [0603-ARC]  40.39,75.56 270 top
RN_B_PT2  47  [0603-ARC]  39.62,88.77 270 top
RN_B_PT3  47  [0603-ARC]  13.33,92.46 0 top
RN_DMS1  47  [0603-ARC]  37.59,65.41 0 top
RN_DMS2  47  [0603-ARC]  24.38,65.28 0 top
RN_DMS3  47  [0603-ARC]  11.43,65.15 0 top
RN_DMS4  47  [0603-ARC]  44.58,8.89 270 top
RN_DMS5  47  [0603-ARC]  31.37,8.89 270 top
RN_DMS6  47  [0603-ARC]  17.02,8.89 270 top
SJ_MS  [SJ_2S-NO]  51.17,65.06 270 bottom
U$1  COMMON_MODE_CHOKE  [COMMON_MODE_CHOKE]  28.7,42.16 90 top
U$2  COMMON_MODE_CHOKE  [COMMON_MODE_CHOKE]  41.78,42.16 90 top
U$3  COMMON_MODE_CHOKE  [COMMON_MODE_CHOKE]  14.73,42.16 90 top
U$4  COMMON_MODE_CHOKE  [COMMON_MODE_CHOKE]  37.21,30.1 270 top
U$5  COMMON_MODE_CHOKE  [COMMON_MODE_CHOKE]  24.13,30.1 270 top
U$6  COMMON_MODE_CHOKE  [COMMON_MODE_CHOKE]  9.65,30.1 270 top
U$7  MICROSD  [MICROSD]  22.23,35.81 90 bottom
U$8  PLT131PLT131-T1  [PLT131-T1]  56.9,16.13 180 top
U$9  PLR135  [PLR135-T1]  85.73,16.13 180 top
U_7805  LM78L05ACMX/NOPB  [SOIC8]  91.82,50.29 0 top
U_ADC_DMS1  ADS1147TSSOP20  [TSSOP20]  39.37,60.07 0 top
U_ADC_DMS2  ADS1147TSSOP20  [TSSOP20]  26.03,59.94 0 top
U_ADC_DMS3  ADS1147TSSOP20  [TSSOP20]  12.95,59.82 0 top
U_ADC_DMS4  ADS1147TSSOP20  [TSSOP20]  39.75,13.84 180 top
U_ADC_DMS5  ADS1147TSSOP20  [TSSOP20]  26.54,13.84 180 top
U_ADC_DMS6  ADS1147TSSOP20  [TSSOP20]  12.06,13.84 180 top
U_ADC_PT1  ADS1147TSSOP20  [TSSOP20]  33.02,76.71 270 top
U_ADC_PT2  ADS1147TSSOP20  [TSSOP20]  32.89,90.17 270 top
U_ADC_PT3  ADS1147TSSOP20  [TSSOP20]  13.21,86.61 0 top
U_ADR366_3  ADR366WAUJZ  [SOT23-5]  73.43,71.35 0 bottom
U_CH340G  CH340G  [SOIC16]  85.6,81.79 180 top
U_FLASH1  S70FL01GS  [SO16]  70.36,88.9 0 top
U_FLASH2  S70FL01GS  [SO16]  56.01,89.03 0 top
U_LT1528  LT1528  [Q5-DD]  67.69,28.96 0 top
U_MAX488  MAX488CSA  [SO08]  99.31,50.29 180 top
U_OPTO_1  MOCD207MSOIC-8  [SOIC127P594X363-8N]  103.12,83.82 0 top
U_OPTO_2  MOCD207MSOIC-8  [SOIC127P594X363-8N]  103.12,90.81 0 top
U_OPTO_3  MOCD207MSOIC-8  [SOIC127P594X363-8N]  99.31,59.44 270 top
U_STM32F779  STM32F77XXXLQFP208  [QFP50P3060X3060X385-208]  63.66,64.32 180 top
U_TRACODCDC  THN10-2411WIR  [THL_20WI_SERIES]  105.66,23.75 90 bottom
X_DMS  403-5X020-5X  [403-5X020-5X]  25.78,36.07 0 top
X_GPIO  403-5X020-5X  [403-5X020-5X]  85.73,67.94 270 top
X_MIRROR  403-5X026-5X  [403-5X026-5X]  115.44,83.57 270 top
X_MIRROR1  403-5X026-5X  [403-5X026-5X]  115.44,83.57 90 bottom
X_PROG  x  [MA10-2]  67.69,42.04 180 top
X_PT  403-5X012-5X  [403-5X012-5X]  14.6,72.14 180 top
X_RXSM-DAPI  403-5X020-5X  [403-5X020-5X]  115.44,62.48 90 top

## Tracks (layer width: path | path; a pad name or v marks a point on that pad's centre or on a via)
3V3  (via drill 0.35)
  Top 0.203: U$2.P$2 v36.7,50.8 36.7,55.28 R1.1 | R1.1 36.45,55.54 U_ADC_DMS1.1 36.45,58.21 v37.08,58.85 | R1.1 35.01,55.37 C5.1 | U_ADC_DMS1.14 40.34,62.14 40.89,61.59 v41.02,61.59 | U_STM32F779.59 73.41,77.97 v73.98,77.41 | U_STM32F779.103 51.41,81.07 v50.95,81.53 | v16.38,93.47 16.13,93.73 13.99,93.73 13.74,93.47 RN_B_PT3.6 | U$3.P$2 9.82,49.01 10.25,49.01 11.33,47.93 20.4,47.93 21.48,49.01 23.42,49.01 U$1.P$2 | RN_B_PT1.6 41.65,75.17 42.93,73.89 42.93,73.43 42.44,72.95 39.93,72.95 39,73.88 C_AVDD_PT1.1 | 60.58,77.09 59.94,76.45 56.52,76.45 55.88,77.09 | 74.41,53.71 74.36,53.71 73.76,54.3 72.3,54.3 71.7,53.71 | X_GPIO.P$B2 88.96,63.5 v89.57,62.89 88.91,62.23 X_GPIO.P$B1 | U_ADC_DMS6.1 15,16.84 15,18.14 15.86,19 R57.1 | C54.1 17.37,20.73 15.86,19.21 R57.1 | U_ADC_DMS5.1 29.46,16.84 29.46,17.49 31.19,19.21 R50.1 31.41,19.43 31.41,20.94 C47.1 29.81,20.99 29.21,21.59 U$5.P$2 | R57.1 15.96,20.07 v15.75,20.28 | 77.09,70.99 76.97,70.87 v76.2,70.87 | 76.47,63.61 76.47,63.87 v76.62,64.02
  Top 0.254: U_STM32F779.115 46.36,72.07 | 46.36,72.07 46.29,72.07 45.72,72.64 v45.72,73.41 | U_STM32F779.118 47.03,70.57 46.36,71.25 46.36,72.07 | U_STM32F779.103 51.41,77.14 51.84,76.71 55.5,76.71 55.88,77.09 55.91,77.12 U_STM32F779.94 | U_STM32F779.83 61.41,77.92 60.58,77.09 | U_STM32F779.73 66.41,80.28 66.29,80.39 C31.1 | 77.09,77.07 74.31,77.07 v73.98,77.41 | 77.09,77.07 U_STM32F779.52 | v75.63,82.36 76.58,81.41 86.23,81.41 | 86.23,81.41 89.03,81.41 90.04,80.39 U_CH340G.16 90.97,79.09 C33.1 94.17,80.08 94.87,80.77 94.87,84.33 97.66,87.12 v100.84,87.12 | 77.09,72.14 77.09,77.07 | U_STM32F779.39 77.51,70.57 77.09,70.99 77.09,72.14 | U_STM32F779.42 77.16,72.07 77.09,72.14 | U_STM32F779.204 74.41,53.71 v76.57,53.71 v76.58,53.72 76.1,54.2 76.1,58.57 | 76.1,58.57 76.1,63.25 76.47,63.61 76.92,64.07 U_STM32F779.26 | U_STM32F779.15 76.1,58.57 | U_STM32F779.137 49.93,61.07 v50.29,60.71 | U_STM32F779.150 46.44,54.57 v46.36,54.48 | v46.36,47.5 50.8,47.5 51.41,48.11 U_STM32F779.158 51.41,50.65 52.32,51.56 56.9,51.56 57.91,50.55 U_STM32F779.171 | U_CH340G.4 86.23,81.41 | 71.7,53.71 69.72,53.71 69.68,53.75 67.73,53.75 64.91,50.93 U_STM32F779.185
  Top 0.305: RN_B_PT2.6 41.76,88.37 42.16,88.77 | 42.16,88.77 43.43,90.04 43.43,93.34 42.87,93.91 RN_A_PT2.8 | 42.16,88.77 42.16,87.12 v41.62,86.58 40.98,85.94 38.2,85.94 C_AVDD_PT2.1 38.15,87.48 36.43,89.19 U_ADC_PT2.14 34.5,89.19 33.02,90.68 33.02,91.57 31.49,93.09 U_ADC_PT2.1 28.7,93.09 28.59,93.21 C_DVDD_PT2.1 | U_FLASH2.2 52.83,87.31 v51.31,88.84 | v65.66,88.84 67.18,87.31 U_FLASH1.2 67.18,83.82 66.3,82.94 C31.1 | v45.72,73.41 45.7,73.43 42.93,73.43 | C_AVDD_PT1.1 38.61,74.55 37.42,75.73 U_ADC_PT1.14 | C_DVDD_PT1.1 28.83,80.14 29.33,79.63 U_ADC_PT1.1 31.11,79.63 v31.75,78.99 | RN_A_PT3.8 7.36,94.22 v6.6,93.47 | v16.38,93.47 16.55,93.31 C_AVDD_PT3.1 16.05,92.2 14.18,90.33 U_ADC_PT3.14 | C_DVDD_PT3.1 v10.12,82.72 10.28,82.89 U_ADC_PT3.1 | RN_A_PT1.8 45.03,80.45 45.09,80.39 44.78,80.39 C68.+ | U$6.P$2 15.11,22.86 15.11,20.92 v15.75,20.28 | U_ADC_DMS6.14 11.09,12.15 10.09,13.15 v10.09,14.73 | U_ADC_DMS5.14 25.57,9.82 v25.53,9.78 | U$5.P$2 30.36,24.38 v31.37,24.38 | U$4.P$2 42.38,23.15 v42.38,20.7 R43.1 42.68,18.37 U_ADC_DMS4.1 | C25.1 38.23,9.27 38.78,9.82 | U_ADC_DMS4.14 38.78,9.82 | 38.78,9.82 38.83,9.76 v38.97,9.76 | v59.69,19.05 v59.69,20.32 | v59.69,20.32 v62.23,20.32 | v59.69,20.32 57.91,20.32 57.53,20.7 | v57.15,19.05 v57.15,20.32 | U_LT1528.2 65.98,21.07 64.3,21.07 | v26.8,61.34 27.01,61.55 U_ADC_DMS2.14 | 22.86,55.41 22.86,56.13 23.11,56.38 U_ADC_DMS2.1 23.11,60.45 v24.13,61.47 | 22.86,55.41 R8.1 22.9,52.54 23.62,51.82 v23.62,51.56 U$1.P$2 | C10.1 21.88,55.03 22.26,55.41 22.86,55.41 | U$3.P$2 9.78,49.15 v9.78,51.05 9.78,52.7 10.2,53.12 R36.1 10.2,55.71 10.03,55.88 U_ADC_DMS3.1
  Top 0.305: C19.1 8.67,56.9 U_ADC_DMS3.1 | U_ADC_DMS3.1 10.03,58.03 v10.67,58.67 | v13.72,61.34 13.93,61.55 U_ADC_DMS3.14
  Top 1.27: v62.23,19.05 63.04,19.05 63.52,18.57 63.59,18.57 C37.2 64.3,21.07 U_LT1528.1 62.99,21.08 v62.23,20.32
  Top 1.778: C68.+ 45.21,78.61 45.34,78.49 v45.72,78.49
  Top 2.54: C41.+ 57.53,20.7 v57.15,20.32
  Route2 0.305: U$9.VCC 78.49,16.13 75.82,13.46 67.06,13.46 62.23,18.29 v62.23,19.05
  Route15 0.203: v76.2,70.87 77.72,69.34 77.72,65.12 v76.62,64.02
  Bottom 0.203: R2.2 37.76,59.78 37.91,59.63 | 37.91,59.63 38.1,59.44 40.01,59.44 40.98,60.41 C3.1 41.53,61.09 v41.02,61.59 | v37.08,58.85 37.86,59.63 37.91,59.63 | v73.98,77.41 76.4,79.83 76.4,81.59 77.39,81.61 79.12,81.61 C69.+ | v50.95,81.53 48.9,81.53 47.24,83.19 | C73.+ 84.52,46.63 82.93,46.63 82.85,46.72 82.44,46.72 82.36,46.63 82.35,46.54 | C72.+ 19.75,64.12 19.63,64.14 | 18.03,11.87 19.53,11.87 C70.+ | 26.23,84.89 26.23,84.85 26.23,82.69 C71.+ | 25.15,8.76 25.53,9.14 v25.53,9.78 | 38.99,8.76 38.99,8.64 39.37,8.26 | C76.1 8.48,50.99 9.84,50.99 | R41.2 10.2,42 10.68,41.51 U$7.4
  Bottom 0.254: 72.46,54.61 72.46,56.7 71.78,57.38 R26.2 68.09,59.04 67.56,59.56 67.56,61.85 68.17,62.45 C32.1 | v76.58,53.72 75.69,54.61 72.46,54.61 | R29.2 50.41,60.82 v50.29,60.71 44.7,60.71 44.41,60.41 | 82.44,46.72 80.9,48.26 80.9,60.07 82.93,62.1 88.78,62.1 v89.57,62.89 102.21,62.89 102.84,62.26 R13.2 | RN12.1 RN12.2 | RN12.2 RN12.3 RN12.4 | v100.84,87.12 100.84,86.94 101.3,86.49 RN12.2 | R28.1 72.46,54.61 | 15.75,13.08 15.75,13.07 16.94,11.87 18.03,11.87
  Bottom 0.305: v65.66,88.84 C29.1 v51.31,88.84 | v65.66,88.84 66.8,88.84 C30.1 | v31.75,78.99 31.75,81.28 31.88,81.41 | v6.6,93.47 10.16,93.47 | 10.16,93.47 v16.38,93.47 20.45,93.47 25.15,88.77 25.15,85.98 26.23,84.89 | v10.12,82.72 10.12,93.43 10.16,93.47 | R62.2 15.07,21.12 15.75,20.45 v15.75,20.28 15.75,14.61 | 15.75,14.61 15.75,13.08 | 15.75,14.61 15.66,14.69 C55.1 R58.2 11.26,14.73 v10.09,14.73 | 25.53,8.76 v25.53,9.78 25.53,14.48 25.74,14.69 R51.2 C48.1 29.08,17.27 30.06,18.25 R55.2 30.06,23.71 30.73,24.38 v31.37,24.38 | 38.99,9.78 38.99,14.61 39.33,14.95 R44.2 C24.1 42.29,20.61 v42.38,20.7 42.76,21.08 R48.2 | 38.99,9.78 38.99,8.76 | v38.97,9.76 38.99,9.78 | R19.2 64.01,17.53 62.48,19.05 v62.23,19.05 | R6.2 36.23,50.33 v36.7,50.8 | R30.2 23.91,61.13 24.13,61.34 24.26,61.34 | 24.26,61.34 v26.8,61.34 27.34,60.79 C9.1 | 24.26,61.34 v24.13,61.47 24,61.59 24,64.08 | R34.2 23.79,51.4 v23.62,51.56 | R41.2 10.2,51.47 v9.78,51.05 9.84,50.99 | v10.67,58.67 11.09,59.09 R37.2 12.15,59.18 12.83,59.18 13.72,60.07 v13.72,61.34 14.57,61.34 C15.1 15.15,60.83 16.38,60.83 16.89,61.34 16.89,63.37 17.65,64.14 19.63,64.14 | C3.1 44.41,60.41 44.45,60.45 | 41.02,81.41 41.02,85.98 v41.62,86.58 | v65.66,88.84 65.66,85.22 65.41,84.96 | 82.35,46.54 81.79,45.97 C28.1 81.59,43.31 X_PROG.1 79.12,48.39 77.02,50.48 R9.2 77.02,53.28 v76.58,53.72 | U$9.VCC 83.19,15.75 85.59,13.34 C78.1
  Bottom 0.762: C77.1 55.75,19.68
  Bottom 1.524: 49.28,8.26 49.75,8.26 50.92,7.08 53.82,7.08 56.9,10.16 U$8.VCC
  Bottom 2.032: C67.+ 57.53,20.7 v57.15,20.32 | v45.72,78.49 v45.72,73.41 45.72,72.01 42.93,69.22 42.93,66.42 | 42.93,66.42 42.93,63.12 44.45,61.59 44.45,60.45 44.45,58.42 46.36,56.52 v46.36,54.48 v46.36,47.5 46.36,36.96 | C67.+ 52.14,23.3 46.36,29.08 46.36,36.96 | v45.72,78.49 45.72,80.64 44.96,81.41 41.02,81.41 31.88,81.41 29.84,81.41 28.7,82.55 C71.+ | 25.53,8.76 38.99,8.76 | 39.37,8.26 49.28,8.26 | C67.+ 55.75,21.52 55.75,19.68 55.75,18.03 56.9,16.89 U$8.VCC | 42.93,66.42 42.8,66.29 28.19,66.29 25.98,64.08 24,64.08 C72.+ | v45.72,78.49 45.72,81.66 47.24,83.19 49.02,84.96 65.41,84.96 73.03,84.96 v75.63,82.36 76.4,81.59 C69.+ | 46.36,36.96 58.67,36.96 59.31,37.59 82.8,37.59 84.58,39.37 84.58,46.57 84.52,46.63 | C70.+ 22.79,8.76 25.15,8.76
  pour Top: 55.37,21.84 55.37,17.14 64.26,17.14 64.26,21.84
  pour Bottom: 64.26,21.84 64.26,17.14 55.37,17.14 55.37,21.84
  pour Route2: 55.37,17.14 64.26,17.14 64.26,21.84 55.37,21.84
  pour Route15: 55.37,21.84 64.26,21.84 64.26,17.14 55.37,17.14
3V3REF  (via drill 0.35)
  Top 0.203: v80.11,71.7 79.98,71.57 U_STM32F779.41
  Bottom 0.203: U_ADR366_3.4 | U_ADR366_3.4 72.48,72.04 72.87,71.65 80.06,71.65 v80.11,71.7 | U_ADR366_3.4 72.01,72.64 71.5,72.14 71.5,71.12 70.83,70.45 R24.2 70.03,68.21 C74.2 68.07,68.01 C75.2
5V  (via drill 0.35)  (1 unrouted)
  Top 0.203: 89.73,23.3 90.11,23.3 90.93,24.13 | U_TRACODCDC.3 97.66,13.59 100.08,16 100.08,20.83 101.35,22.1 R66.3
  Top 0.305: U_LT1528.4 U_LT1528.5 76.71,21.08 77.66,20.13 v78.74,19.05 | v80.64,45.47 80.64,40.64 | 80.64,40.64 80.64,33.91 81.53,33.02 81.53,23.88 80.7,23.04 C40.+ | X_RXSM-DAPI.P$A9 119.51,58.04 120.52,57.02 120.52,53.09 119.13,51.69 110.72,51.69 103.48,44.45 98.3,44.45 94.49,40.64 80.64,40.64
  Top 0.508: U_TRACODCDC.3 C36.2
  Top 1.27: v73.66,20.32 71.85,20.32 U_LT1528.5 71.11,21.07 C35.2 72.44,17.83 v73.66,19.05
  Top 2.032: U_TRACODCDC.3 95.5,17.53 89.73,23.3 89.03,24 85.98,24 | 77.66,20.13 78.23,19.56 80.01,19.56 84.45,24 85.98,24 | C39.+ 86.11,24.13 85.98,24
  Top 2.54: C40.+ 77.85,21.21 v78.74,20.32
  Bottom 0.305: R18.2 66.17,15.37 66.8,16 70.1,16 70.23,15.88 71.75,15.88 73.66,17.78 v73.66,19.05 | U_ADR366_3.3 C52.2 72.48,65.87 73.46,64.9 77.6,64.9 79.88,62.61 79.88,46.23 v80.64,45.47
  Bottom 2.032: C66.+ 77.85,21.21 v78.74,20.32 v76.2,20.32 | v78.74,19.05 78.79,19 79.45,19 82.73,22.28 C65.+ 84.45,22.73 86.11,24.38 C64.+ | v76.2,20.32 v73.66,20.32 v73.66,19.05 | v76.2,19.05 v76.2,20.32
  pour Bottom: 80.01,21.84 80.01,17.14 71.12,17.14 71.12,21.84
  pour Top: 71.12,21.84 71.12,17.14 80.01,17.14 80.01,21.84
  pour Route15: 80.01,21.84 80.01,17.14 71.12,17.14 71.12,21.84
  pour Route2: 80.01,21.84 80.01,17.14 71.12,17.14 71.12,21.84
5V-28V  (via drill 0.35)
  Top 0.305: C43.1 91.31,44.58 v90.04,45.85 89.92,45.97 U_7805.1 89.92,49.4 90.81,50.29 100.46,50.29 101.79,51.62 | 101.79,51.62 101.53,51.62 101.22,51.94 U_MAX488.1 | 101.79,51.62 R14.2 106.61,51.62 107.64,52.64 R16.1
  Bottom 0.305: v90.04,45.85 90.04,44.2 91.69,42.55 91.69,19.3 90.93,18.54 82.3,18.54 80.14,16.38 76.84,16.38 76.33,15.88 R21.2
28V  (via drill 0.35)
  Top 0.203: v111.12,78.49 111.12,79.5 111.38,79.76 X_MIRROR1.P$A10 X_MIRROR1.P$A11 X_MIRROR1.P$A12
  Top 0.305: U_7805.8 89.92,54.48 v90.23,54.8 90.64,55.21 C42.2 | v107.82,86.23 110.62,89.03 v110.62,89.28
  Top 0.508: C34.2 120.02,21.72 119.25,20.95 116.08,20.95 U_TRACODCDC.1
  Top 0.762: X_RXSM-DAPI.P$B2 112.14,66.93 109.86,69.22 109.86,69.54 | 109.91,69.49 109.91,70.05
  Top 1.016: X_RXSM-DAPI.P$B2 X_RXSM-DAPI.P$B1 111.76,68.2 109.91,70.05 108.49,71.47 C62.+ | v106.55,74.8 v106.55,76.07
  Top 1.27: 111.76,68.2 111.76,67.94 112.14,67.56 | 109.91,69.49 109.86,69.54 107.92,71.47 C62.+
  Top 2.032: U_TRACODCDC.1 112.14,21.21 110.49,22.86 110.49,40.64 111.35,41.5 | 111.35,41.5 C38.+ v112.07,43.94 v112.07,44.96 v112.07,45.97 C60.+ 111.94,48.26 | 111.35,41.5 111.33,41.53 C61.+ 109.2,41.53 110.36,42.7 | C62.+ 106.7,75.92 v106.55,76.07 v106.55,77.34 107.7,78.49 v111.12,78.49 v109.86,78.49
  Route2 0.203: v87.38,8.76 82.8,8.76 82.42,8.38 80.26,8.38 79.5,9.15 79.5,14.03 79.88,14.41 v79.88,14.54
  Bottom 0.203: v111.12,78.49 X_MIRROR1.P$A11 | X_MIRROR1.P$A11 X_MIRROR1.P$A10 | X_MIRROR1.P$A11 X_MIRROR1.P$A12 | R20.2 v79.88,14.54 | v87.38,8.76 108.84,8.76 115.82,15.75 115.82,20.07
  Bottom 0.305: 115.82,20.07 U_TRACODCDC.1 | v90.23,54.8 95.25,49.78 95.25,46.61 96.52,45.34 111.69,45.34 v112.07,44.96 | RN11.1 RN11.2 RN11.3 RN11.4 110.54,89.35 v110.62,89.28 | 108.23,78.49 108.23,85.83 v107.82,86.23
  Bottom 2.032: v112.07,43.94 v112.07,44.96 v112.07,45.97 111.76,46.28 111.76,68.58 106.55,73.79 v106.55,77.34 107.7,78.49 | v109.86,78.49 108.23,78.49
28VGND  (via drill 0.35)
  Top 0.203: v119.38,83.57 X_MIRROR1.P$B7 X_MIRROR1.P$B8 X_MIRROR1.P$B9 X_MIRROR1.P$B10 X_MIRROR1.P$B11 X_MIRROR1.P$B12 X_MIRROR1.P$B13 | X_MIRROR1.P$B13 X_MIRROR1.P$A13 112.99,75.65 X_MIRROR1.P$BL3 | LED8.C LED7.C 79.82,7.21 80.67,8.05 85.73,8.05 86.69,7.09 105.99,7.09 v106.63,7.72 | U_7805.2 U_7805.3 92.46,46.48 93.53,45.41 C43.2 94.34,44.58 v94.74,44.98 | U_7805.7 U_7805.6 92.46,56.1 C42.1 93,56.64 v95.5,56.64 97.41,56.64 | C61.- v97.41,41.53 | C44.2 105.41,62.1 106.7,63.4 C62.- 105.64,65.79 v103.12,65.79 | X_RXSM-DAPI.P$A6 120.02,61.85 v120.14,61.72 121.28,60.58 121.28,50.85 C60.- C38.- 118.75,41.43 118.75,29.21 U_TRACODCDC.2 | v120.27,68.07 118.32,68.07 X_RXSM-DAPI.P$A1 X_RXSM-DAPI.P$A2 | X_MIRROR1.P$B13 117.89,75.65 v117.89,74.93 X_MIRROR1.P$BL1 | v120.52,93.6 117.99,93.6 X_MIRROR1.P$BL2 117.86,93.7 116.24,95.31 114.65,95.31 113.03,93.7 X_MIRROR1.P$BL4
  Top 0.254: U_MAX488.4 97.41,56.64 U_OPTO_3.5
  Top 0.305: C44.2 105.6,60.58 R17.1 | C34.1 120.02,25.65 119.38,26.29 U_TRACODCDC.2
  Route2 0.203: 106.68,7.72 v106.63,7.72 106.81,7.9 106.81,32.13 v97.41,41.53 | v117.89,74.93 119.04,73.79 119.63,73.79 120.27,73.15 v120.27,68.07 | v120.52,93.6 120.52,84.71 v119.38,83.57 | v120.14,61.72 120.14,64.42 121.05,65.33 121.05,65.98 120.59,66.44 119.94,66.44 119.79,66.29 103.63,66.29 v103.12,65.79 97.79,60.45 95.5,60.45 94.23,59.18 94.23,57.91 v95.5,56.64 93.98,55.12 93.98,45.74 v94.74,44.98
  Route15 0.203: v120.14,61.72 120.14,64.14 121.28,65.28 121.28,67.06 v120.27,68.07
  Bottom 0.203: X_MIRROR1.P$B13 X_MIRROR1.P$B12 X_MIRROR1.P$B11 X_MIRROR1.P$B10 X_MIRROR1.P$B9 X_MIRROR1.P$B8 X_MIRROR1.P$B7 v119.38,83.57 | X_MIRROR1.P$B13 X_MIRROR1.P$A13 112.99,75.65 X_MIRROR1.P$BL3 | v97.41,41.53 94.74,44.2 v94.74,44.98 | D6.A 97.71,54.43 | 97.71,54.43 D5.A v95.5,56.64 | R11.1 98.31,57.15 98.17,57.15 97.71,56.69 97.71,54.43 | X_MIRROR1.P$BL1 v117.89,74.93 117.89,75.65 X_MIRROR1.P$B13 | X_MIRROR1.P$BL4 113.03,93.7 114.65,95.31 116.24,95.31 117.86,93.7 X_MIRROR1.P$BL2 120.43,93.7 v120.52,93.6
  other vias: 89.92,42.42 108.2,46.61 105.16,41.66 115.44,48.26 115.57,41.53 107.06,35.31 115.06,30.48 108.71,18.8 111.76,15.75 116.2,12.57 115.44,9.02 101.47,78.23 104.01,75.06 110.11,74.68 98.81,94.49
  pour Bottom: 121.92,5.71 121.92,95.76 97.79,95.76 97.79,79.38 101.47,75.69 101.47,67.31 98.04,63.88 94.87,63.88 93.09,62.1 93.09,59.56 91.69,58.17 89.03,58.17 88.27,57.4 88.27,40.13 91.06,37.34 97.16,37.34 104.65,29.84 104.65,5.71
  pour Top: 121.92,5.71 121.92,95.76 97.79,95.76 97.79,79.38 101.47,75.69 101.47,67.31 98.04,63.88 94.87,63.88 93.09,62.1 93.09,59.56 91.69,58.17 89.03,58.17 88.27,57.4 88.27,40.13 91.06,37.34 97.16,37.34 104.65,29.84 104.65,5.71
  pour Route15: 121.92,5.71 121.92,95.76 97.79,95.76 97.79,79.38 101.47,75.69 101.47,67.31 98.04,63.88 94.87,63.88 93.09,62.1 93.09,59.56 91.69,58.17 89.03,58.17 88.27,57.4 88.27,40.13 91.06,37.34 97.16,37.34 104.65,29.84 104.65,5.71
  pour Route2: 121.92,5.71 121.92,95.76 97.79,95.76 97.79,79.38 101.47,75.69 101.47,67.31 98.04,63.88 94.87,63.88 93.09,62.1 93.09,59.56 91.69,58.17 89.03,58.17 88.27,57.4 88.27,40.13 91.06,37.34 97.16,37.34 104.65,29.84 104.65,5.71
!CS!_DMS1  (via drill 0.35)
  Top 0.203: v47.17,69.52 45.44,69.52 42.42,66.5 40.26,66.5 R3.2 | U_STM32F779.74 65.95,79.23 65.95,78.37 65.86,78.28 65.86,76.4 63.51,74.05 v61.63,74.05
  Route2 0.203: v61.63,74.05 57.32,69.74 54.1,69.74 52.59,68.22 48.46,68.22 v47.17,69.52
!CS!_DMS2  (via drill 0.35)
  Top 0.203: U_STM32F779.75 65.41,77.22 v64.01,75.82 | R31.2 27.09,66.42 34.09,66.42 v35.81,68.14
  Route2 0.203: v39.6,69.11 40.56,68.15 41.73,68.15 44.83,71.25 48.64,71.25 50.61,69.27 52.02,69.27 55.93,73.19 v55.93,75.39
  Bottom 0.203: v64.01,75.82 63.37,75.18 56.13,75.18 v55.93,75.39 | v39.6,69.11 39.01,69.7 38.61,69.7 37.37,69.7 v35.81,68.14
!CS!_DMS3  (via drill 0.35)
  Top 0.203: v22.12,66.28 21.91,66.06 14.13,66.06 R38.2 | v62.93,80.75 64.44,80.75 64.87,80.31 64.87,79.45 U_STM32F779.76
  Route2 0.203: v22.12,66.28 41.34,66.28 45.44,70.38 48.29,70.38 49.86,68.81 52.41,68.81 57.21,73.6 57.21,75.03 v62.93,80.75
!CS!_DMS4
  Top 0.203: U_STM32F779.77 64.41,77.52 61.81,74.91 61.21,74.91 60.77,74.47 60.77,58.29 55.8,53.33 53.43,53.33 49.54,49.44 47.17,49.44 45.44,47.71 45.44,47.28 46.74,45.99 46.74,14.86 48.51,13.08 48.51,7.61 47.51,6.6 42.8,6.6 42.04,7.37 R45.2
!CS!_DMS5  (via drill 0.35)
  Top 0.203: R52.2 27.9,6.82 27.18,6.1 23.24,6.1 22.35,6.99 v21.59,6.99 | U_STM32F779.78 63.91,78.01 62.15,76.25 61.54,76.25 v61.49,76.2 | v54.53,68.1 v54.53,64.03
  Route2 0.203: v54.53,64.03 52.07,61.57 49.78,61.57 47.97,59.75 46.55,59.75 44.58,57.78 44.58,55.88 42.42,53.72 42.42,31.5 32.26,21.34 32.26,12.06 28.96,8.76 22.48,8.76 21.59,7.87 v21.59,6.99
  Route15 0.203: v61.49,76.2 54.53,69.25 v54.53,68.1
!CS!_DMS6  (via drill 0.35)
  Top 0.203: v55.37,54.19 55.37,70.38 59.93,74.94 59.93,75.75 61.96,77.79 62.78,77.79 63.36,78.37 63.36,79.23 U_STM32F779.79 | v48.64,6.48 49.33,7.16 v49.33,46.63 | R59.2 14.6,7.37 v14.99,6.99
  Route2 0.203: v49.33,46.63 51.45,48.76 52.18,48.76 54.12,50.69 54.12,51.42 55.37,52.68 v55.37,54.19
  Route15 0.203: v48.64,6.48 47.75,5.59 16.38,5.59 v14.99,6.99
!CS!_PT1  (via drill 0.35)
  Top 0.203: U_STM32F779.117 49.58,71.07 50.8,69.85 50.8,67.18 51.05,66.93 v51.56,66.93 | RN_B_PT1.7 42.65,75.97 v42.7,75.92
  Route15 0.203: v51.56,66.93 50.37,66.93 48.64,68.66 46.91,68.66 44.07,71.5 43.84,71.5 43.08,72.26 43.08,75.08 42.7,75.46 v42.7,75.92
!CS!_PT2  (via drill 0.35)
  Top 0.203: U_STM32F779.116 49.79,71.57 51.3,70.06 v51.69,70.06 | RN_B_PT2.7 41.04,89.17 v41.4,89.53
  Route2 0.203: v51.69,70.06 50.84,70.06 46.56,74.35 46.56,89.33 46.1,89.79 v44.58,89.79
  Route15 0.203: v41.4,89.53 41.4,93.22 42.02,93.84 43.07,93.84 44.58,92.33 v44.58,89.79
!CS!_PT3  (via drill 0.35)
  Top 0.203: v43.81,75.49 43.9,75.57 U_STM32F779.108 | v22.48,93.73 21.95,94.26 13.28,94.26 12.94,93.91 RN_B_PT3.7
  Route2 0.203: v43.81,75.49 43.59,75.72 43.59,76.17 41.01,78.75 41.01,78.9 36.78,83.13 36.78,84.48 35.79,85.47 29.84,85.47 22.48,92.84 v22.48,93.73
!DRDY!_DMS1  (via drill 0.35)
  Top 0.203: v39.54,68.01 38.96,67.44 38.96,66.06 RN_DMS1.5 | v45.57,63.2 46.89,63.2 47.82,64.12 48.68,64.12 U_STM32F779.131
  Route15 0.203: v39.54,68.01 44.35,63.2 v45.57,63.2
!DRDY!_DMS2  (via drill 0.35)
  Top 0.203: RN_DMS2.5 26.05,65.9 26.38,65.58 28.02,65.58 28.45,65.15 31.75,65.15 v34.54,62.36 | U_STM32F779.142 49.81,58.57 v50.55,59.31
  Route15 0.203: v50.55,59.31 47.75,59.31 47.12,59.94 45.75,59.94 44.86,60.83 42.55,60.83 42.16,60.45 36.45,60.45 v34.54,62.36
!DRDY!_DMS3  (via drill 0.35)
  Top 0.203: v10.25,68.66 10.46,68.44 11.54,68.44 12.62,67.36 12.62,65.85 RN_DMS3.5 | v33.13,57.43 33.78,57.43 36.59,60.24 46.52,60.24 47.6,59.16 47.6,58.29 47.82,58.08 U_STM32F779.143
  Route2 0.203: v10.25,68.66 9.82,68.22 9.6,68.22 9.17,67.79 9.17,66.93 13.06,63.04 27.52,63.04 v33.13,57.43
!DRDY!_DMS4  (via drill 0.35)
  Top 0.203: U_STM32F779.144 50.36,57.57 v51.13,58.34 | RN_DMS4.5 46.68,7.69 47.62,8.64 v47.62,10.03
  Route2 0.203: v51.13,58.34 51.97,59.18 52.96,59.18 53.34,58.8 53.34,57.28 53.62,57 53.62,56.03 49.4,51.82 48.01,51.82 47.37,51.18 47.37,45.59 48.77,44.2 48.77,10.92 48.32,10.48 48.13,10.29 47.88,10.03 v47.62,10.03
!DRDY!_DMS5  (via drill 0.35)
  Top 0.203: v32.77,7.06 32.51,7.06 31.99,7.58 RN_DMS5.5 | U_STM32F779.145 51.1,57.07 52.32,58.29 v52.45,58.29
  Route2 0.203: v32.77,7.06 32.77,7.7 34.54,9.48 34.54,20.45 43.69,29.59 43.69,53.98 47.12,57.4 51.56,57.4 v52.45,58.29
!DRDY!_DMS6  (via drill 0.35)
  Top 0.203: U_STM32F779.146 48.9,56.57 51.45,56.57 52.31,57.43 53.21,57.43 53.65,57 53.65,56.13 53.43,55.92 53.43,54.41 48.9,49.87 46.95,49.87 45.01,47.93 45.01,47.07 45.97,46.1 45.97,14.55 46.74,13.79 v46.74,12.95 | v20.07,6.6 19.18,6.6 18.09,7.69 RN_DMS6.5
  Route15 0.203: v46.74,12.95 46.74,7.42 45.34,6.02 20.65,6.02 v20.07,6.6
!DRDY!_PT1  (via drill 0.35)
  Top 0.203: RN_B_PT1.8 41.84,76.77 v41.85,76.75 | v61.7,51.94 60.91,51.15 U_STM32F779.177
  Route2 0.203: v41.85,76.75 41.85,75.5 42.29,75.06 42.29,74.4 42.82,73.86 42.82,71.14 41.76,70.08 v41.38,70.08
  Route15 0.203: v41.38,70.08 41.38,69.49 42.62,68.25 42.62,66.02 44.65,63.98 50.32,63.98 53,61.3 53,60.92 58.17,55.75 58.17,54.48 60.71,51.94 v61.7,51.94
!DRDY!_PT2  (via drill 0.35)
  Top 0.203: RN_B_PT2.8 40.25,90.23 39.63,90.86 39.17,90.86 38.89,91.14 v38.43,91.14 | U_STM32F779.176 60.41,47.63 v60.33,47.55
  Route2 0.203: v60.33,47.55 60.33,52.32 64.01,56.01 v64.26,56.01 | v42.04,84.96 43.36,83.64 v43.59,83.64
  Route15 0.203: v64.26,56.01 61.34,56.01 51.44,65.91 50.42,65.91 48.11,68.22 46.74,68.22 44.22,70.74 43.18,70.74 42.7,71.22 42.7,72.03 42.65,72.08 42.65,74.12 40.87,75.89 40.87,76.91 41.49,77.53 43.24,77.53 44.32,78.61 44.32,82.91 v43.59,83.64 | v38.43,91.14 39.88,89.69 39.88,89.03 41.02,87.88 42.04,87.88 42.55,87.38 42.55,85.47 v42.04,84.96
!DRDY!_PT3  (via drill 0.35)
  Top 0.203: v30.76,94.13 30.2,94.69 12.84,94.69 12.19,94.04 12.19,93.12 RN_B_PT3.8 | v59.47,55.05 59.47,50.74 59.91,50.3 59.91,49.44 U_STM32F779.175
  Route15 0.203: v30.76,94.13 32.7,92.19 32.7,91.97 42.2,82.47 42.2,79.92 39.4,77.11 39.4,72.39 40.91,70.88 41.77,70.88 43.05,69.6 43.05,68.15 44.74,66.46 48.93,66.46 53.43,61.96 53.43,61.1 v59.47,55.05
DAPI_N  (via drill 0.35)
  Top 0.203: X_RXSM-DAPI.P$B9 v114.3,58.04
  Top 0.305: U_CH340G.6 83.69,86.61 v83.82,86.74
  Route15 0.203: v114.3,58.04 114.3,60.33 88.9,85.72 84.84,85.72 v83.82,86.74
  Bottom 0.305: D1.C 88.9,86.11 84.45,86.11 v83.82,86.74
DAPI_P  (via drill 0.35)
  Top 0.203: v114.3,56.77 X_RXSM-DAPI.P$B10
  Top 0.305: U_CH340G.5 84.96,87.38 v85.34,87.76
  Route15 0.203: v85.34,87.76 88.39,87.76 115.7,60.45 115.7,58.17 v114.3,56.77
  Bottom 0.305: v85.34,87.76 89.41,91.82 D2.C
DAPI_RX  (via drill 0.35)
  Top 0.254: U_CH340G.2 88.77,82.42 v88.65,82.3 | U_STM32F779.11 80.06,56.57 81.15,57.66 v81.15,61.72
  Bottom 0.254: v88.65,82.3 83.78,77.43 83.78,74.71 85.47,73.03 85.47,68.33 85.09,67.94 82.93,67.94 | 82.93,67.94 D4.C | v81.15,61.72 81.15,63.3 82.93,65.08 82.93,67.94
DAPI_TX  (via drill 0.35)
  Top 0.254: U_STM32F779.43 79.96,72.57 v80.34,72.95 | v87.5,82.93 U_CH340G.3
  Bottom 0.254: v80.34,72.95 80.34,76.66 82.04,78.36 82.93,78.36 v87.5,82.93
  Bottom 0.305: D3.C 81.41,71.63 80.34,72.69 v80.34,72.95
DMS11
  Top 0.203: U$2.P$1 36.7,41.29 36.45,41.04 30.37,41.04 28.96,39.62 X_DMS.P$B3
DMS12
  Top 0.203: U$2.P$3 39.24,41.15 38.7,40.6 31.46,40.6 30.23,39.37 X_DMS.P$B2
DMS13
  Top 0.203: X_DMS.P$B1 31.5,39.5 32.17,40.17 40.68,40.17 41.78,41.27 U$2.P$5
DMS21
  Top 0.203: U$1.P$1 23.62,41.15 25.15,39.62 X_DMS.P$B6
DMS22
  Top 0.203: U$1.P$3 26.16,40.77 26.42,40.51 X_DMS.P$B5
DMS23
  Top 0.203: X_DMS.P$B4 27.69,39.75 28.7,40.77 U$1.P$5
DMS31
  Top 0.203: X_DMS.P$B9 21.34,39.5 20.57,40.26 10.16,40.26 9.65,40.77 U$3.P$1
DMS32
  Top 0.203: U$3.P$3 12.19,41.15 12.57,40.77 21.46,40.77 22.61,39.62 X_DMS.P$B8
DMS33
  Top 0.203: X_DMS.P$B7 23.88,39.37 21.97,41.27 14.99,41.27 14.73,41.53 U$3.P$5
DMS41
  Top 0.203: U$4.P$1 42.29,30.73 41.15,31.88 32.26,31.88 31.5,32.64 X_DMS.P$A1
DMS42
  Top 0.203: U$4.P$3 39.75,30.73 39.12,31.37 31.62,31.37 30.23,32.77 X_DMS.P$A2
DMS43
  Top 0.203: U$4.P$5 37.21,30.35 36.73,30.84 31.01,30.84 30.25,31.6 29.97,31.6 28.96,32.61 X_DMS.P$A3
DMS51
  Top 0.203: X_DMS.P$A4 27.69,32.13 29.21,30.61 U$5.P$1
DMS52
  Top 0.203: U$5.P$3 26.54,30.23 26.54,31.5 26.42,31.62 X_DMS.P$A5
DMS53
  Top 0.203: X_DMS.P$A6 25.15,32.26 24.13,31.24 U$5.P$5
DMS61
  Top 0.203: U$6.P$1 14.73,30.86 14.86,30.99 22.48,30.99 23.88,32.38 X_DMS.P$A7
DMS62
  Top 0.203: U$6.P$3 12.19,30.43 13.21,31.45 21.79,31.45 22.61,32.26 X_DMS.P$A8
DMS63
  Top 0.203: U$6.P$5 9.65,31.11 10.41,31.88 20.57,31.88 21.34,32.64 X_DMS.P$A9
EXP_IN  (via drill 0.35)
  Top 0.254: v101.22,60.58 U_OPTO_3.1 | U_MAX488.2 99.95,54.61 100.46,55.12 104.14,55.12 v104.65,54.61
  Bottom 0.254: v101.22,60.58 101.09,60.45 101.09,56.64 101.98,55.75 101.98,55.24 D5.C 104.52,54.48 v104.65,54.61
EXP_IN_N  (via drill 0.35)
  Top 0.203: X_RXSM-DAPI.P$B3 111.38,65.66 109.73,64.01 109.73,60.77 R17.2 | U_MAX488.7 99.95,46.1 100.33,45.72 102.74,45.72 v103.38,46.35
  Top 0.305: R15.1 v109.53,59.56 R17.2
  Route2 0.203: v103.38,46.35 103,46.74 103,50.42 109.53,56.96 v109.53,59.56
EXP_IN_OPT  (via drill 0.35)
  Top 0.254: U_STM32F779.200 72.41,47.22 73.03,46.61 81.03,46.61 84.33,49.91 84.33,53.72 88.39,57.78 96.52,57.78 96.77,58.04 100.71,58.04 101.22,57.53 U_OPTO_3.8 102.04,56.7 v102.36,57.02
  Bottom 0.254: v102.36,57.02 102.84,57.51 R13.1 103.55,58.46 104.14,59.05 104.14,62.1 99.7,66.55 D10.C
EXP_IN_P
  Top 0.203: X_RXSM-DAPI.P$B4 111.89,64.39 111.12,63.63 111.12,57.02 110.36,56.26 R10.2 | U_MAX488.8 101.24,47.24 104.27,47.24 104.78,47.75 104.78,48.9 106.43,50.55 107.31,50.55 109.53,52.77 R16.2
  Top 0.305: R16.2 R10.2
EXP_OUT  (via drill 0.35)
  Top 0.203: 98.55,52.9 98.55,53.33 U_MAX488.3 98.55,52.9 | 98.55,52.9 98.55,52.68 97.47,51.6 91.43,51.6 89.05,49.23 89.05,45.12 91.03,43.14 94.61,43.14 95.56,44.08 95.56,47.52 97.69,49.66 103.3,49.66 R14.1 | 98.55,52.9 v100.06,51.38
  Top 0.254: U_MAX488.3 U_OPTO_3.6
  Bottom 0.203: v100.06,51.38 100.5,50.95 102.65,50.95 D6.C
EXP_OUT_N  (via drill 0.35)
  Top 0.203: X_RXSM-DAPI.P$A3 v120.27,65.66 | v105.66,48.26 105.66,47.5 103.38,45.21 99.06,45.21 98.68,45.59 U_MAX488.6
  Route2 0.203: v120.27,65.66 105.66,51.05 v105.66,48.26
EXP_OUT_OPT
  Top 0.203: 93.85,58.42 95.06,59.63 97.22,59.63
  Top 0.254: U_OPTO_3.3 98.68,61.09 97.22,59.63 | U_STM32F779.201 72.91,48.12 73.91,47.12 80.64,47.12 83.69,50.16 83.69,54.36 87.76,58.42 93.85,58.42
EXP_OUT_P  (via drill 0.35)
  Top 0.203: U_MAX488.5 97.41,48.64 97.92,49.15 101.47,49.15 102.49,48.13 v103.89,48.13 | v116.59,64.39 X_RXSM-DAPI.P$A4
  Route2 0.203: v103.89,48.13 103.89,50.16 116.59,62.87 v116.59,64.39
FL_1_CS1  (via drill 0.35)
  Top 0.203: U_STM32F779.104 50.91,80.15 50.67,80.39 v50.16,80.39 | v73.03,88.27 73.53,87.76 U_FLASH1.7
  Route2 0.203: v50.16,80.39 50.16,82.3 51.82,83.95 71.25,83.95 73.53,86.23 73.53,87.76 v73.03,88.27
FL_1_CS2  (via drill 0.35)
  Top 0.203: U_FLASH1.6 72.26,83.32 v72.41,83.17 | U_STM32F779.102 51.91,82.14 v51.94,82.17
  Route2 0.203: v72.41,83.17 52.95,83.17 v51.94,82.17
FL_1_HLD
  Top 0.203: U_FLASH1.1 65.91,84.71 64.52,83.31 54.61,83.31 53.41,82.11 U_STM32F779.99
FL_1_RES  (via drill 0.35)
  Top 0.203: U_FLASH1.3 68.45,84.45 69.98,82.93 v69.98,81.79 | v52.38,77.64 52.41,77.67 U_STM32F779.101
  Route2 0.203: v69.98,81.79 56.59,81.79 52.45,77.64 v52.38,77.64
FL_1_WP
  Top 0.203: U_STM32F779.100 52.91,82.25 54.41,83.74 63.17,83.74 64.52,85.09 64.52,94.74 65.73,95.96 74.09,95.96 74.8,95.25 U_FLASH1.9
FL_2_CS1  (via drill 0.35)
  Top 0.203: U_STM32F779.112 49.7,73.57 51.51,71.75 v52.05,71.75 | v59.39,88 59.18,87.8 U_FLASH2.7
  Route15 0.203: v59.39,88 59.39,87.33 59.18,87.12 59.18,79.76 54.99,75.56 54.99,72.77 54,71.78 52.07,71.78 v52.05,71.75
FL_2_CS2  (via drill 0.35)
  Top 0.203: U_FLASH2.6 57.91,87.62 v58.29,88 | v53.75,72.75 53.57,72.57 51.46,72.57 49.96,74.07 U_STM32F779.111
  Route15 0.203: v58.29,88 58.29,80.01 54.36,76.07 54.36,73.3 53.8,72.75 v53.75,72.75
FL_2_HLD  (via drill 0.35)
  Top 0.203: U_STM32F779.109 50.79,75.07 v51.56,74.3 | v50.29,86.66 51,85.95 U_FLASH2.1
  Route2 0.203: v51.56,74.3 48.01,77.85 48.01,84.38 v50.29,86.66
FL_2_RES  (via drill 0.35)
  Top 0.203: U_STM32F779.110 50.14,74.57 51.31,73.41 v52.43,73.41 | v54.36,88 54.1,87.75 U_FLASH2.3
  Route15 0.203: v52.43,73.41 52.45,73.43 52.45,76.2 54.74,78.49 54.74,87.62 v54.36,88
FL_2_WP  (via drill 0.35)
  Top 0.203: U_FLASH2.9 60.45,91.44 v59.56,90.55 | U_STM32F779.113 49.59,73.07 50.83,71.83 50.83,71.42 51.28,70.97 53.32,70.97 55.07,72.72 55.07,73.46 53.65,74.88 52.25,74.88 v51.56,75.56
  Route2 0.203: v59.56,90.55 53.85,84.84 51.44,84.84 48.64,82.04 48.64,78.49 v51.56,75.56
GND  (via drill 0.35)  (60 unrouted)